# Altium project SAM3X-EK_REVB.PrjPcb (part 1 of 2)
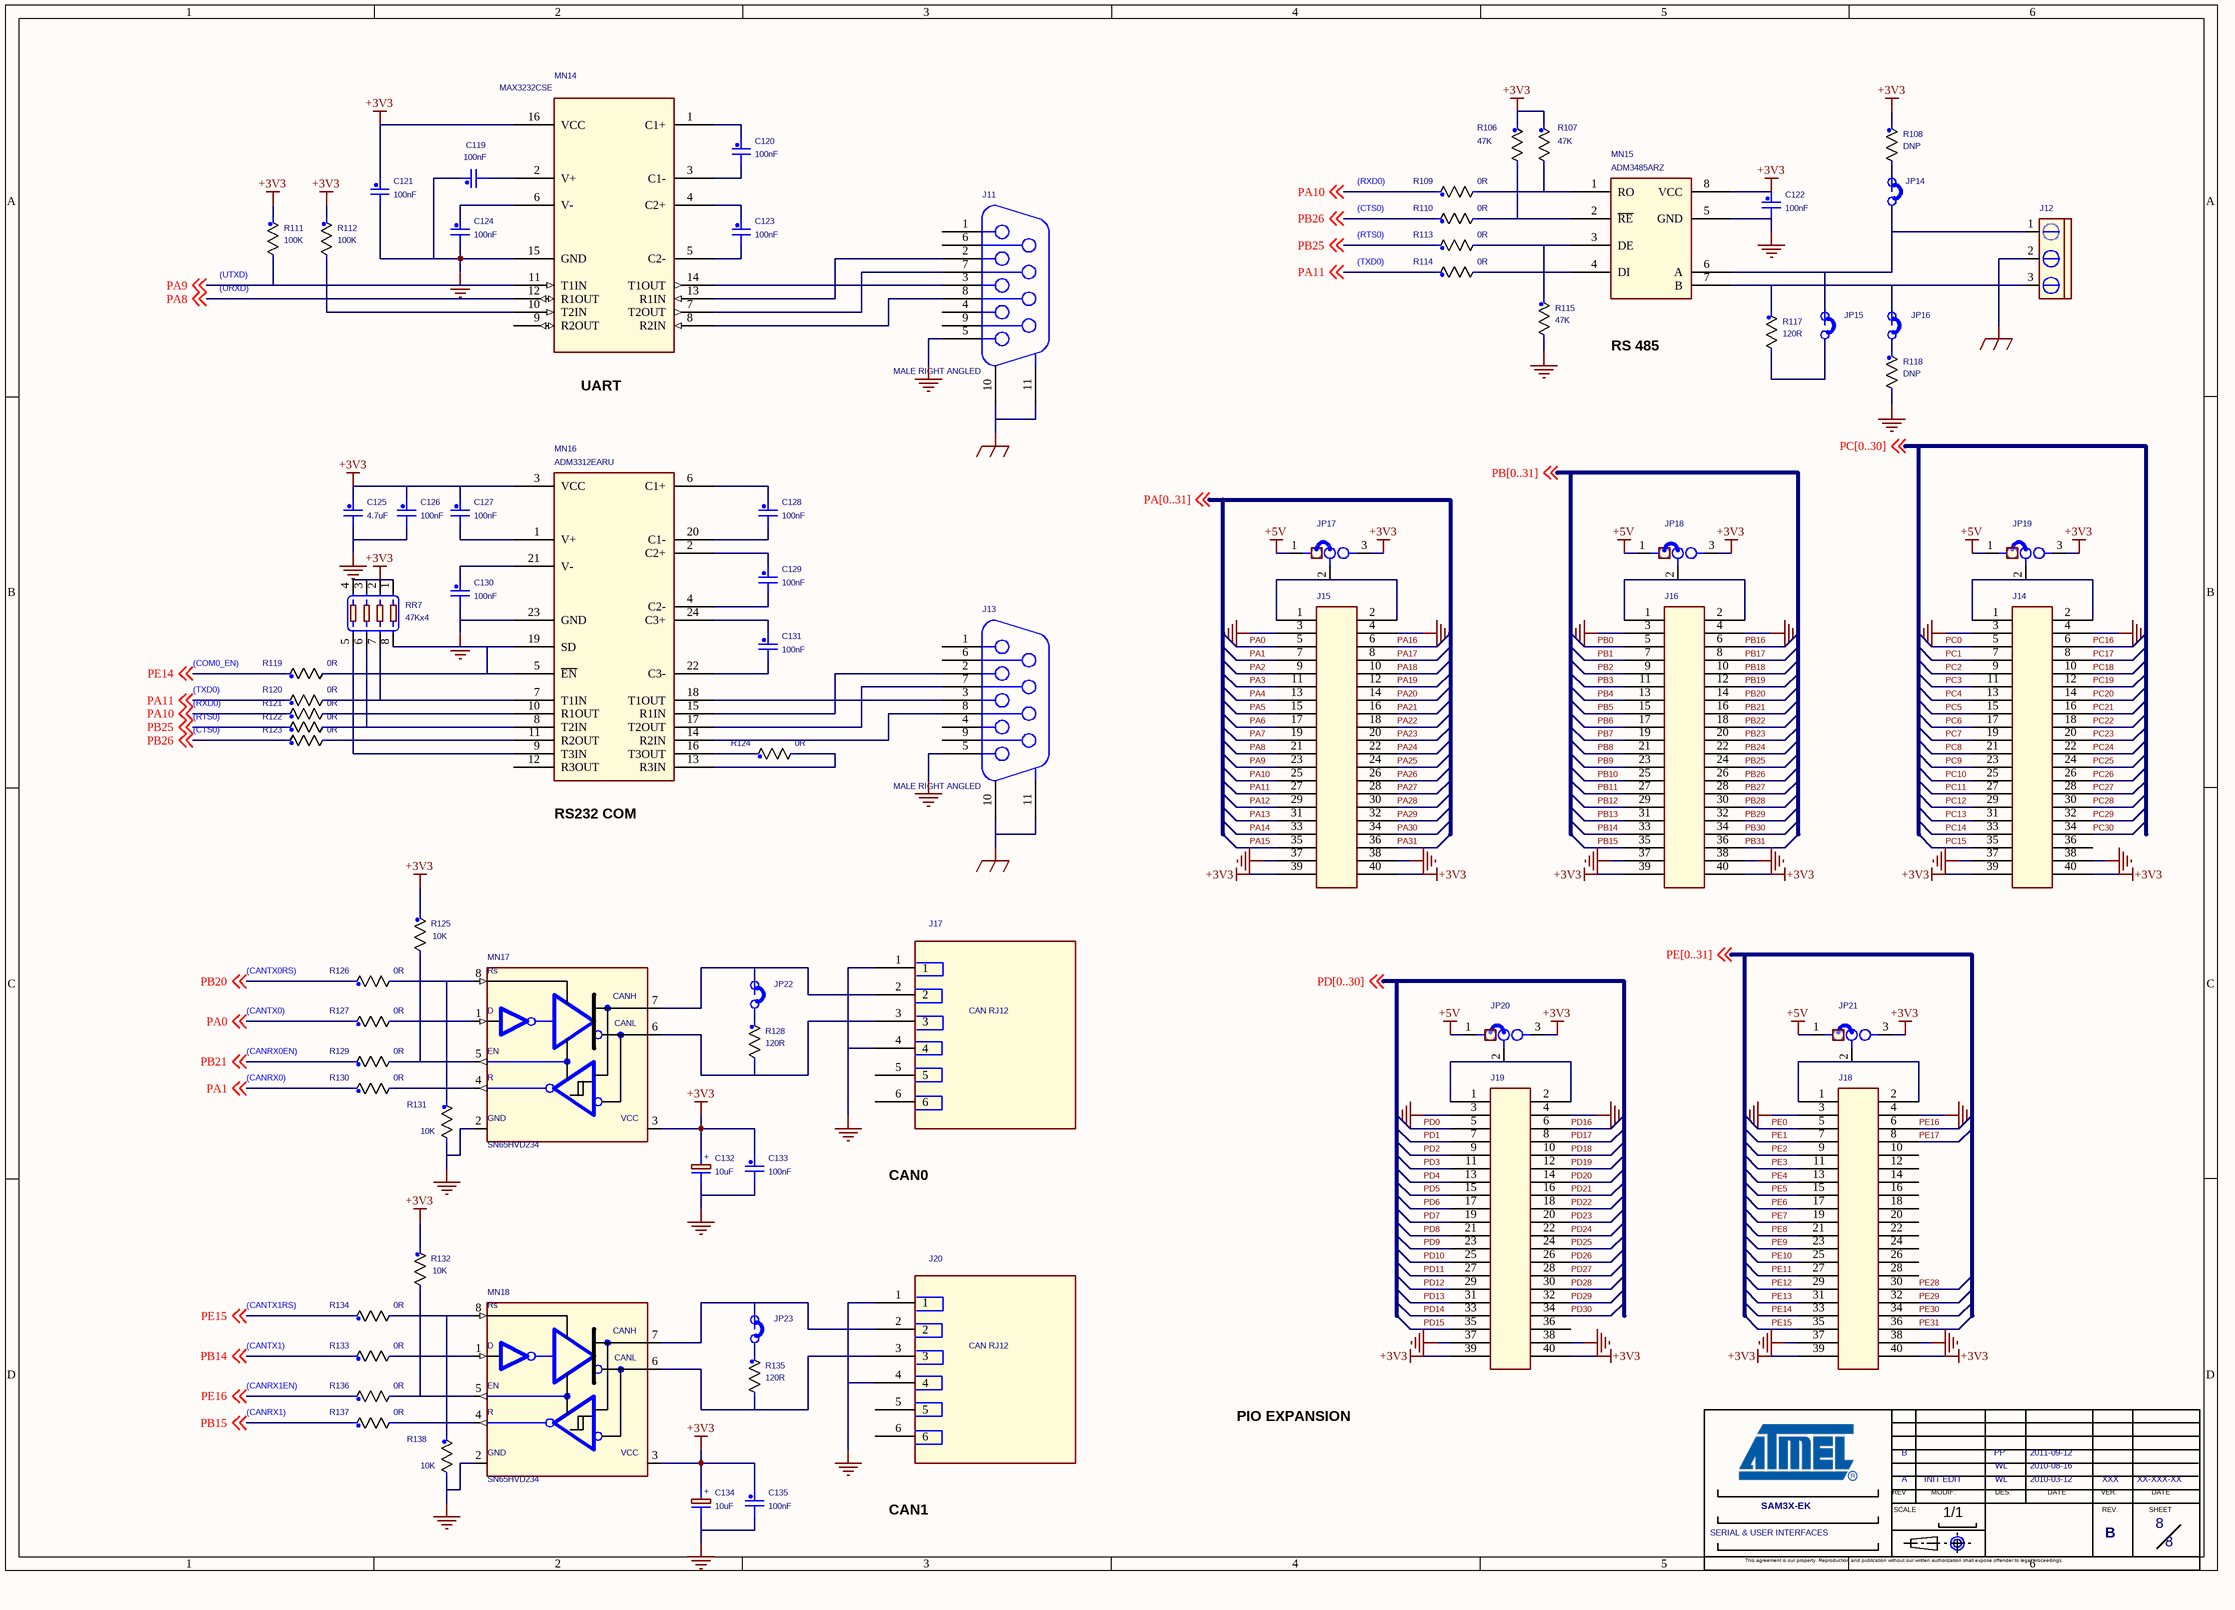
[diagram p0: 08_SERIAL & USER INTERF.SchDoc]
8 sheets, 417 parts. Net scope: global (net labels, ports and power ports of the same name join across sheets).
Sheets:
  08_SERIAL & USER INTERF.SchDoc
  07_ETHERNET & ZIGBEE.SchDoc
  06_Audio & HSMCI & TWI.SchDoc
  05_DISPLAY & QTouch.SchDoc
  04_EBI_MEMORY.SchDoc
  03_ATSAM3X_LFBGA217.SchDoc
  02_POWER SUPPLY & USB &.SchDoc
  01_TOP LEVEL.SchDoc

## Sheet 08_SERIAL & USER INTERF.SchDoc
size 420 x 297 mm

### Parts
(Parts that share a designator on the sheet are numbered #1, #2 ... from top to bottom, then left to right.)
*#1  SHEET NAME 1: SERIAL & USER INTERFACES  REV C: B  VERIF A: XXX  VERIF DATE A: XX-XXX-XX  Page Count: 8  DATE A: 2010-03-12  DATE B: 2010-08-16  DATE C: 2011-09-12  DES A: WL  DES C: PP  BOARD NAME: SAM3X-EK  VERSION: A  MODIF. DESCRIBE: INIT EDIT  (hidden comment: ATMEL ARM)  (graphical)
C119  100nF  [CAP0805]
C120  100nF  [CAP0805]
C121  100nF  [CAP0805]
C122  100nF  [CAP0805]
C123  100nF  [CAP0805]
C124  100nF  [CAP0805]
C125  4.7uF  [CAP0805]
C126  100nF  [CAP0805]
C127  100nF  [CAP0805]
C128  100nF  [CAP0805]
C129  100nF  [CAP0805]
C130  100nF  [CAP0805]
C131  100nF  [CAP0805]
C132  10uF  [C3216-18]
C133  100nF  [CAP0805]
C134  10uF  [C3216-18]
C135  100nF  [CAP0805]
J11  VAL: MALE RIGHT ANGLED  [SUBD9M_H_C]  (hidden comment: SUBD9_M_COUDE)
J12  7143-035S  [7143-035s]  (value not drawn)
J13  VAL: MALE RIGHT ANGLED  [SUBD9M_H_C]  (hidden comment: SUBD9_M_COUDE)
J14  048  [jms_tsm-2x20pts]  (value not drawn)
J15  048  [jms_tsm-2x20pts]  (value not drawn)
J16  048  [jms_tsm-2x20pts]  (value not drawn)
J17  CAN RJ12  [RJ12-55503]
J18  048  [jms_tsm-2x20pts]  (value not drawn)
J19  048  [jms_tsm-2x20pts]  (value not drawn)
J20  CAN RJ12  [RJ12-55503]
JP14  JP  [BAR2PTS02]  (value not drawn)
JP15  JP  [BAR2PTS02]  (value not drawn)
JP16  JP  [BAR2PTS02]  (value not drawn)
JP17  header3-100  [BAR3PTS02]  (value not drawn)
JP18  header3-100  [BAR3PTS02]  (value not drawn)
JP19  header3-100  [BAR3PTS02]  (value not drawn)
JP20  header3-100  [BAR3PTS02]  (value not drawn)
JP21  header3-100  [BAR3PTS02]  (value not drawn)
JP22  JP  [BAR2PTS02]  (value not drawn)
JP23  JP  [BAR2PTS02]  (value not drawn)
MN14  MAX3232CSE  [so16]
MN15  ADM3485ARZ  [so8]
MN16  ADM3312EARU  [tssop24]
MN17  SN65HVD234  [SO08]
MN18  SN65HVD234  [SO08]
R106  47K  [R0603]
R107  47K  [R0603]
R108  DNP  [r0603]
R109  0R  [r0603]
R110  0R  [r0603]
R111  100K  [r0603]
R112  100K  [r0603]
R113  0R  [r0603]
R114  0R  [r0603]
R115  47K  [R0603]
R117  120R  [r0603]
R118  DNP  [r0603]
R119  0R  [r0603]
R120  0R  [r0603]
R121  0R  [r0603]
R122  0R  [r0603]
R123  0R  [r0603]
R124  0R  [r0603]
R125  10K  [R0603]
R126  0R  [r0603]
R127  0R  [r0603]
R128  120R  [r0603]
R129  0R  [r0603]
R130  0R  [r0603]
R131  10K  [R0603]
R132  10K  [R0603]
R133  0R  [r0603]
R134  0R  [r0603]
R135  120R  [r0603]
R136  0R  [r0603]
R137  0R  [r0603]
R138  10K  [R0603]
RR7  47Kx4  [RESP4R]
SH20  Jumper Pitch 2.54  [JUMPER-2.54]  (value not drawn)
SH21  Jumper Pitch 2.54  [JUMPER-2.54]  (value not drawn)
SH22  Jumper Pitch 2.54  [JUMPER-2.54]  (value not drawn)
SH23  Jumper Pitch 2.54  [JUMPER-2.54]  (value not drawn)
SH24  Jumper Pitch 2.54  [JUMPER-2.54]  (value not drawn)
SH25  Jumper Pitch 2.54  [JUMPER-2.54]  (value not drawn)
SH26  Jumper Pitch 2.54  [JUMPER-2.54]  (value not drawn)
SH27  Jumper Pitch 2.54  [JUMPER-2.54]  (value not drawn)
SH28  Jumper Pitch 2.54  [JUMPER-2.54]  (value not drawn)
SH29  Jumper Pitch 2.54  [JUMPER-2.54]  (value not drawn)

### Nets
+3V3: C121.1 C122.1 C125.1 C126.1 C127.1 C132.1 C133.1 C134.1 C135.1 J14.39 J14.40 J15.39 J15.40 J16.39 J16.40 J18.39 J18.40 J19.39 J19.40 JP17.3 JP18.3 JP19.3 JP20.3 JP21.3 MN14.16(VCC) MN15.8(VCC) MN16.3(VCC) MN17.3(VCC) MN18.3(VCC) R106.1 R107.1 R108.1 R111.1 R112.1 R125.1 R132.1 RR7.1 RR7.2 RR7.3 RR7.4
+5V: JP17.1 JP18.1 JP19.1 JP20.1 JP21.1
GND_EARTH: J11.10(M1) J11.11(M2) J12.2 J13.10(M1) J13.11(M2)
GND_POWER: C119.1 C121.2 C122.2 C124.2 C125.2 C126.2 C130.2 C132.2 C133.2 C134.2 C135.2 J11.5 J13.5 J14.3 J14.4 J14.37 J14.38 J15.3 J15.4 J15.37 J15.38 J16.3 J16.4 J16.37 J16.38 J17.1 J17.4 J18.3 J18.4 J18.37 J18.38 J19.3 J19.4 J19.37 J19.38 J20.1 J20.4 MN14.15(GND) MN15.5(GND) MN16.23(GND) MN17.2(GND) MN18.2(GND) R115.2 R118.2 R131.2 R138.2
PA0: J15.5 R127.1 ; off-sheet PA0
PA1: J15.7 R130.1 ; off-sheet PA1
PA2: J15.9
PA3: J15.11
PA4: J15.13
PA5: J15.15
PA6: J15.17
PA7: J15.19
PA8: J15.21 MN14.12(R1OUT) ; off-sheet PA8
PA9: J15.23 MN14.11(T1IN) R111.2 ; off-sheet PA9
PA10: J15.25 R109.1 R121.1 ; off-sheet PA10
PA11: J15.27 R114.1 R120.1 ; off-sheet PA11
PA12: J15.29
PA13: J15.31
PA14: J15.33
PA15: J15.35
PA16: J15.6
PA17: J15.8
PA18: J15.10
PA19: J15.12
PA20: J15.14
PA21: J15.16
PA22: J15.18
PA23: J15.20
PA24: J15.22
PA25: J15.24
PA26: J15.26
PA27: J15.28
PA28: J15.30
PA29: J15.32
PA30: J15.34
PA31: J15.36
PB0: J16.5
PB1: J16.7
PB2: J16.9
PB3: J16.11
PB4: J16.13
PB5: J16.15
PB6: J16.17
PB7: J16.19
PB8: J16.21
PB9: J16.23
PB10: J16.25
PB11: J16.27
PB12: J16.29
PB13: J16.31
PB14: J16.33 R133.1 ; off-sheet PB14
PB15: J16.35 R137.1 ; off-sheet PB15
PB16: J16.6
PB17: J16.8
PB18: J16.10
PB19: J16.12
PB20: J16.14 R126.1 ; off-sheet PB20
PB21: J16.16 R129.1 ; off-sheet PB21
PB22: J16.18
PB23: J16.20
PB24: J16.22
PB25: J16.24 R113.1 R122.1 ; off-sheet PB25
PB26: J16.26 R110.1 R123.1 ; off-sheet PB26
PB27: J16.28
PB28: J16.30
PB29: J16.32
PB30: J16.34
PB31: J16.36
PC0: J14.5
PC1: J14.7
PC2: J14.9
PC3: J14.11
PC4: J14.13
PC5: J14.15
PC6: J14.17
PC7: J14.19
PC8: J14.21
PC9: J14.23
PC10: J14.25
PC11: J14.27
PC12: J14.29
PC13: J14.31
PC14: J14.33
PC15: J14.35
PC16: J14.6
PC17: J14.8
PC18: J14.10
PC19: J14.12
PC20: J14.14
PC21: J14.16
PC22: J14.18
PC23: J14.20
PC24: J14.22
PC25: J14.24
PC26: J14.26
PC27: J14.28
PC28: J14.30
PC29: J14.32
PC30: J14.34
PD0: J19.5
PD1: J19.7
PD2: J19.9
PD3: J19.11
PD4: J19.13
PD5: J19.15
PD6: J19.17
PD7: J19.19
PD8: J19.21
PD9: J19.23
PD10: J19.25
PD11: J19.27
PD12: J19.29
PD13: J19.31
PD14: J19.33
PD15: J19.35
PD16: J19.6
PD17: J19.8
PD18: J19.10
PD19: J19.12
PD20: J19.14
PD21: J19.16
PD22: J19.18
PD23: J19.20
PD24: J19.22
PD25: J19.24
PD26: J19.26
PD27: J19.28
PD28: J19.30
PD29: J19.32
PD30: J19.34
PE0: J18.5
PE1: J18.7
PE2: J18.9
PE3: J18.11
PE4: J18.13
PE5: J18.15
PE6: J18.17
PE7: J18.19
PE8: J18.21
PE9: J18.23
PE10: J18.25
PE11: J18.27
PE12: J18.29
PE13: J18.31
PE14: J18.33 R119.1 ; off-sheet PE14
PE15: J18.35 R134.1 ; off-sheet PE15
PE16: J18.6 R136.1 ; off-sheet PE16
PE17: J18.8
PE28: J18.30
PE29: J18.32
PE30: J18.34
PE31: J18.36
NetC119_2: C119.2 MN14.2(V+)
NetC120_1: C120.1 MN14.1(C1+)
NetC120_2: C120.2 MN14.3(C1-)
NetC123_1: C123.1 MN14.4(C2+)
NetC123_2: C123.2 MN14.5(C2-)
NetC124_1: C124.1 MN14.6(V-)
NetC127_2: C127.2 MN16.1(V+)
NetC128_1: C128.1 MN16.6(C1+)
NetC128_2: C128.2 MN16.20(C1-)
NetC129_1: C129.1 MN16.2(C2+)
NetC129_2: C129.2 MN16.4(C2-)
NetC130_1: C130.1 MN16.21(V-)
NetC131_1: C131.1 MN16.24(C3+)
NetC131_2: C131.2 MN16.22(C3-)
NetJ11_2: J11.2 MN14.13(R1IN)
NetJ11_3: J11.3 MN14.14(T1OUT)
NetJ11_7: J11.7 MN14.7(T2OUT)
NetJ11_8: J11.8 MN14.8(R2IN)
NetJ12_1: J12.1 JP14.2 JP15.1 MN15.6(A)
NetJ12_3: J12.3 JP16.1 MN15.7(B) R117.1
NetJ13_2: J13.2 MN16.15(R1IN)
NetJ13_3: J13.3 MN16.18(T1OUT)
NetJ13_7: J13.7 MN16.17(T2OUT)
NetJ13_8: J13.8 MN16.14(R2IN)
NetJ14_1: J14.1 J14.2 JP19.2
NetJ15_1: J15.1 J15.2 JP17.2
NetJ16_1: J16.1 J16.2 JP18.2
NetJ17_2: J17.2 JP22.1 MN17.7(CANH)
NetJ17_3: J17.3 MN17.6(CANL) R128.2
NetJ18_1: J18.1 J18.2 JP21.2
NetJ19_1: J19.1 J19.2 JP20.2
NetJ20_2: J20.2 JP23.1 MN18.7(CANH)
NetJ20_3: J20.3 MN18.6(CANL) R135.2
NetJP14_1: JP14.1 R108.2
NetJP15_2: JP15.2 R117.2
NetJP16_2: JP16.2 R118.1
NetJP22_2: JP22.2 R128.1
NetJP23_2: JP23.2 R135.1
NetMN14_10: MN14.10(T2IN) R112.2
NetMN15_1: MN15.1(RO) R107.2 R109.2
NetMN15_2: MN15.2(~{RE}) R106.2 R110.2
NetMN15_3: MN15.3(DE) R113.2 R115.1
NetMN15_4: MN15.4(DI) R114.2
NetMN16_5: MN16.5(~{EN}) MN16.19(SD) R119.2 RR7.8
NetMN16_7: MN16.7(T1IN) R120.2 RR7.7
NetMN16_8: MN16.8(T2IN) R122.2 RR7.6
NetMN16_9: MN16.9(T3IN) RR7.5
NetMN16_10: MN16.10(R1OUT) R121.2
NetMN16_11: MN16.11(R2OUT) R123.2
NetMN16_13: MN16.13(R3IN) R124.2
NetMN16_16: MN16.16(T3OUT) R124.1
NetMN17_1: MN17.1(TXD) R127.2
NetMN17_4: MN17.4(RXD) R130.2
NetMN17_5: MN17.5(VREF) R125.2 R129.2
NetMN17_8: MN17.8(RS) R126.2 R131.1
NetMN18_1: MN18.1(TXD) R133.2
NetMN18_4: MN18.4(RXD) R137.2
NetMN18_5: MN18.5(VREF) R132.2 R136.2
NetMN18_8: MN18.8(RS) R134.2 R138.1

Not connected (* = marked no-connect by the designer): J11 1 4 6 9; J13 1 4 6 9; J14 36; J17 5 6; J18 10 12 14 16 18 20 22 24 26 28; J19 36; J20 5 6; MN14 9(R2OUT); MN16 12(R3OUT)

### Notes on the sheet
- (RXD0)
- (RTS0)
- (CTS0)
- (near R111) (UTXD)
- (near R111) (URXD)
- (TXD0)
- UART
- RS 485
- (COM0_EN)
- (near MN16) RS232 COM
- (CANTX0RS)
- (CANTX0)
- (CANRX0EN)
- (CANRX0)
- CAN0
- (CANTX1RS)
- (CANRX1EN)
- (CANTX1)
- (CANRX1)
- PIO EXPANSION
- CAN1
- (in symbol ATMEL ARM) REV; MODIF.; DES.; DATE; VER.; SCALE; REV.; SHEET; 1/1; This agreement is our property. Reproduction and publication without our written authorization shall expose offender to legal proceedings.
- (in symbol CAP_PN) +
- (in symbol SN65HVD234 SO8) Rs; D; EN; R

### Library data of the parts
*#1 = ATMEL ARM: REV D: D; REV F: F; REV E: E; REV B: B; VERIF F: XXX; VERIF E: XXX; VERIF D: XXX; VERIF C: XXX; VERIF B: XXX; VERIF DATE F: XX-XXX-XX; VERIF DATE E: XX-XXX-XX; VERIF DATE D: XX-XXX-XX; VERIF DATE C: XX-XXX-XX; REV: B; VERIF DATE B: XX-XXX-XX; FT: ?; Page Number: 8; Page Size: A; Page Create Date: june 19, 2004; DATE D: XX-XXX-XX; DATE E: XX-XXX-XX; DATE F: XX-XXX-XX; DES E: XXX; DES F: XXX; DES B: WL; DES D: XXX
C119 C121 C123 C127 C128 C131 C133 C135 = C_Generic: Toler.: 10%; P/N #1: C0603C104K4RAC; Voltage: 16V; Mfg #1: KEMET; Dielectric: X7R; REF: C1608X7R1C104KT; FAB: TDK; DEV: C0603; DESIG: Ceramic Capacitor; BOI: 0603; TOL: 10%; TEN: 16V; VAL: 100nF
C120 C122 C124 C126 C129 C130 = C_Generic: Toler.: 10%; P/N #1: C0603C104K4RAC; Voltage: 16V; Mfg #1: KEMET; Dielectric: X7R; BOI: 0603; DESIG: Ceramic Capacitor; DEV: C0603; FAB: TDK; REF: C1608X7R1C104KT; VAL: 100nF; TEN: 16V; TOL: 10%
C125 = C_Generic: Toler.: 10%; P/N #1: C0603C104K4RAC; Voltage: 16V; Mfg #1: KEMET; Dielectric: X5R; BOI: 0805; DESIG: X5R CERAMIC CAPACITOR; DEV: C0805; FAB: TDK; REF: C2012X5R1C475KT; VAL: 4.7uF; TEN: 16V; TOL: 10%
C132 C134 = CAP_PN: SDTSourceLibName: C:\WINDOWS\TEMP\SNDS.LIB; BOI: A; DESIG: LOW ESR TANTALUM CAPACITOR; DEV: 3216; FAB: AVX; REF: TPSA106K010R1800; TEN: 10V; TOL: 10%; Dielectric: X5R; VAL: 10uF
J11 J13 = SUBD9_M_COUDE: DESIG: D-SUB 9  RIGHT ANGLED MALE; FAB: leyconn; REF: 021000014; DEV: SUBD9M_H_C
J12 = MKDS 1/3-3.81: FAB: LEYCO; DESIG: 3 Positions, 5.0 mm pitch Printed circuit terminal block; DEV: TBT_MKDS1-3X3-81_01; VAL: 7143-035S; REF: 7143-035S
J14 J16 = SDIC40_2.54mm: DESIG: 2.54mm Pin Header,Dual Row,S.M.T; FAB: SHENZHEN SITUO; REF: 048; VAL: 048
J15 J18 J19 = SDIC40_2.54mm: FAB: SHENZHEN SITUO; DESIG: 2.54mm Pin Header,Dual Row,S.M.T; VAL: 048; REF: 048
J17 J20 = RJ12-6: FAB: leyconn; VAL: 55503; REF: 55503
JP14-JP16 JP22 JP23 = JUMP_0: DESIG: 2.54mm Pin Header,Single Row,Straight/Right Angle(2pin); FAB: SHENZHEN SITUO; REF: 045; VAL: 045
JP17-JP21 = TSW 3PTS-DROIT_0: DESIG: Single Row Terminal Strips; BOI: TSW; FAB: SAMTEC; RoHS: YES; DEV: HEADER3-100; REF: header3-100; VAL: header3-100; PN: header3-100
MN14 = max232: FAB: MAXIM; DESIG: Tranceiver RS232; VAL: MAX3232CSE; REF: MAX3232CSE; DEV: SO16; BOI: SO16
MN15 = ADM3394: FAB: ADI; DESIG: Half-Duplex RS-485 Transceiver; BOI: SOIC8; Val: ADM3485ARZ; REF: ADM3485ARZ
MN16 = ADM3312E: FAB: ADI; DESIG: Serial Port Tranceiver; BOI: TSSOP24; REF: ADM3312EARU; Val: ADM3312EARU
MN17 MN18 = SN65HVD234 SO8: FAB: TI; BOI: SO8; DESIG: 3.3V CAN TRANCEIVER; REF: SN65HVD234D; VAL: SN65HVD234; DEV: SO08
R106 R107 = R_Generic: P/N #1: CR10-1001F-T; BOI: 0603; DESIG: RC21 5%; FAB: YAGEO; REF: RC0603JR-0747KL; TOL: 5%; DEV: R0603; VAL: 47K
R108 = R_Generic: P/N #1: CR10-1001F-T; TOL: 5%; VAL: NOT POPULATED; FAB: YAGEO; DESIG: RC21 5%; BOI: 0603; DEV: R0603
R109 R110 R114 R124 R126 R127 R130 R133 R134 R137 = R_Generic: P/N #1: CR10-1001F-T; TOL: 5%; REF: RC0603JR-070RL; FAB: YAGEO; DESIG: RC21 5%; BOI: 0603; VAL: 0R; DEV: R0603
R111 = R_Generic: P/N #1: CR10-1001F-T; TOL: 5%; REF: RC0603JR-07100KL; FAB: YAGEO; DESIG: RC21 5%; BOI: 0603; VAL: 100K; DEV: R0603
R112 = R_Generic: P/N #1: CR10-1001F-T; BOI: 0603; DESIG: RC21 5%; FAB: YAGEO; REF: RC0603JR-07100KL; TOL: 5%; DEV: R0603; VAL: 100K
R113 R119-R123 R129 R136 = R_Generic: P/N #1: CR10-1001F-T; BOI: 0603; DESIG: RC21 5%; FAB: YAGEO; REF: RC0603JR-070RL; TOL: 5%; DEV: R0603; VAL: 0R
R115 = R_Generic: P/N #1: CR10-1001F-T; TOL: 5%; REF: RC0603JR-0747KL; FAB: YAGEO; DESIG: RC21 5%; BOI: 0603; VAL: 47K; DEV: R0603
R117 = R_Generic: P/N #1: CR10-1001F-T; BOI: 0603; DESIG: RC21 5%; FAB: YAGEO; REF: RC0603JR-07120RL; TOL: 5%; DEV: R0603; VAL: 120R
R118 = R_Generic: P/N #1: CR10-1001F-T; BOI: 0603; DESIG: RC21 5%; FAB: YAGEO; VAL: NOT POPULATED; TOL: 5%; DEV: R0603
R125 R131 R132 R138 = R_Generic: P/N #1: CR10-1001F-T; TOL: 5%; REF: RC0603JR-0710KL; FAB: YAGEO; DESIG: RC21 5%; BOI: 0603; VAL: 10K; DEV: R0603
R128 R135 = R_Generic: P/N #1: CR10-1001F-T; TOL: 5%; REF: RC0603JR-07120RL; FAB: YAGEO; DESIG: RC21 5%; BOI: 0603; VAL: 120R; DEV: R0603
RR7 = RES_ARRAY: TOL: 5%; REF: YC124JR-0747K; FAB: YAGEO; DESIG: Chip Resistor Arrays; BOI: YC124; VAL: 47Kx4
SH20-SH22 SH26 SH29 = JUMPER-2.54: Jumper,2 Points Jumper Pitch 2.54; Part Number: 440-00002-1; Manufacturer: WIESON; Manufacturer Part Number: G4160-1A60BF1U; FAB: NA; REF: JUMPER 2.54; DESIG: 2 POINTS JUMPER PITCH 2.54; VAL: JUMPER 2.54; BOI: NA; Part Type: Jumper
SH23-SH25 SH27 SH28 = JUMPER-2.54: Jumper,2 Points Jumper Pitch 2.54; Manufacturer Part Number: G4160-1A60BF1U; Manufacturer: WIESON; Part Number: 440-00002-1; FAB: NA; REF: JUMPER 2.54; DESIG: 2 POINTS JUMPER PITCH 2.54; VAL: JUMPER 2.54; BOI: NA; Part Type: Jumper

## Sheet 07_ETHERNET & ZIGBEE.SchDoc
size 420 x 297 mm
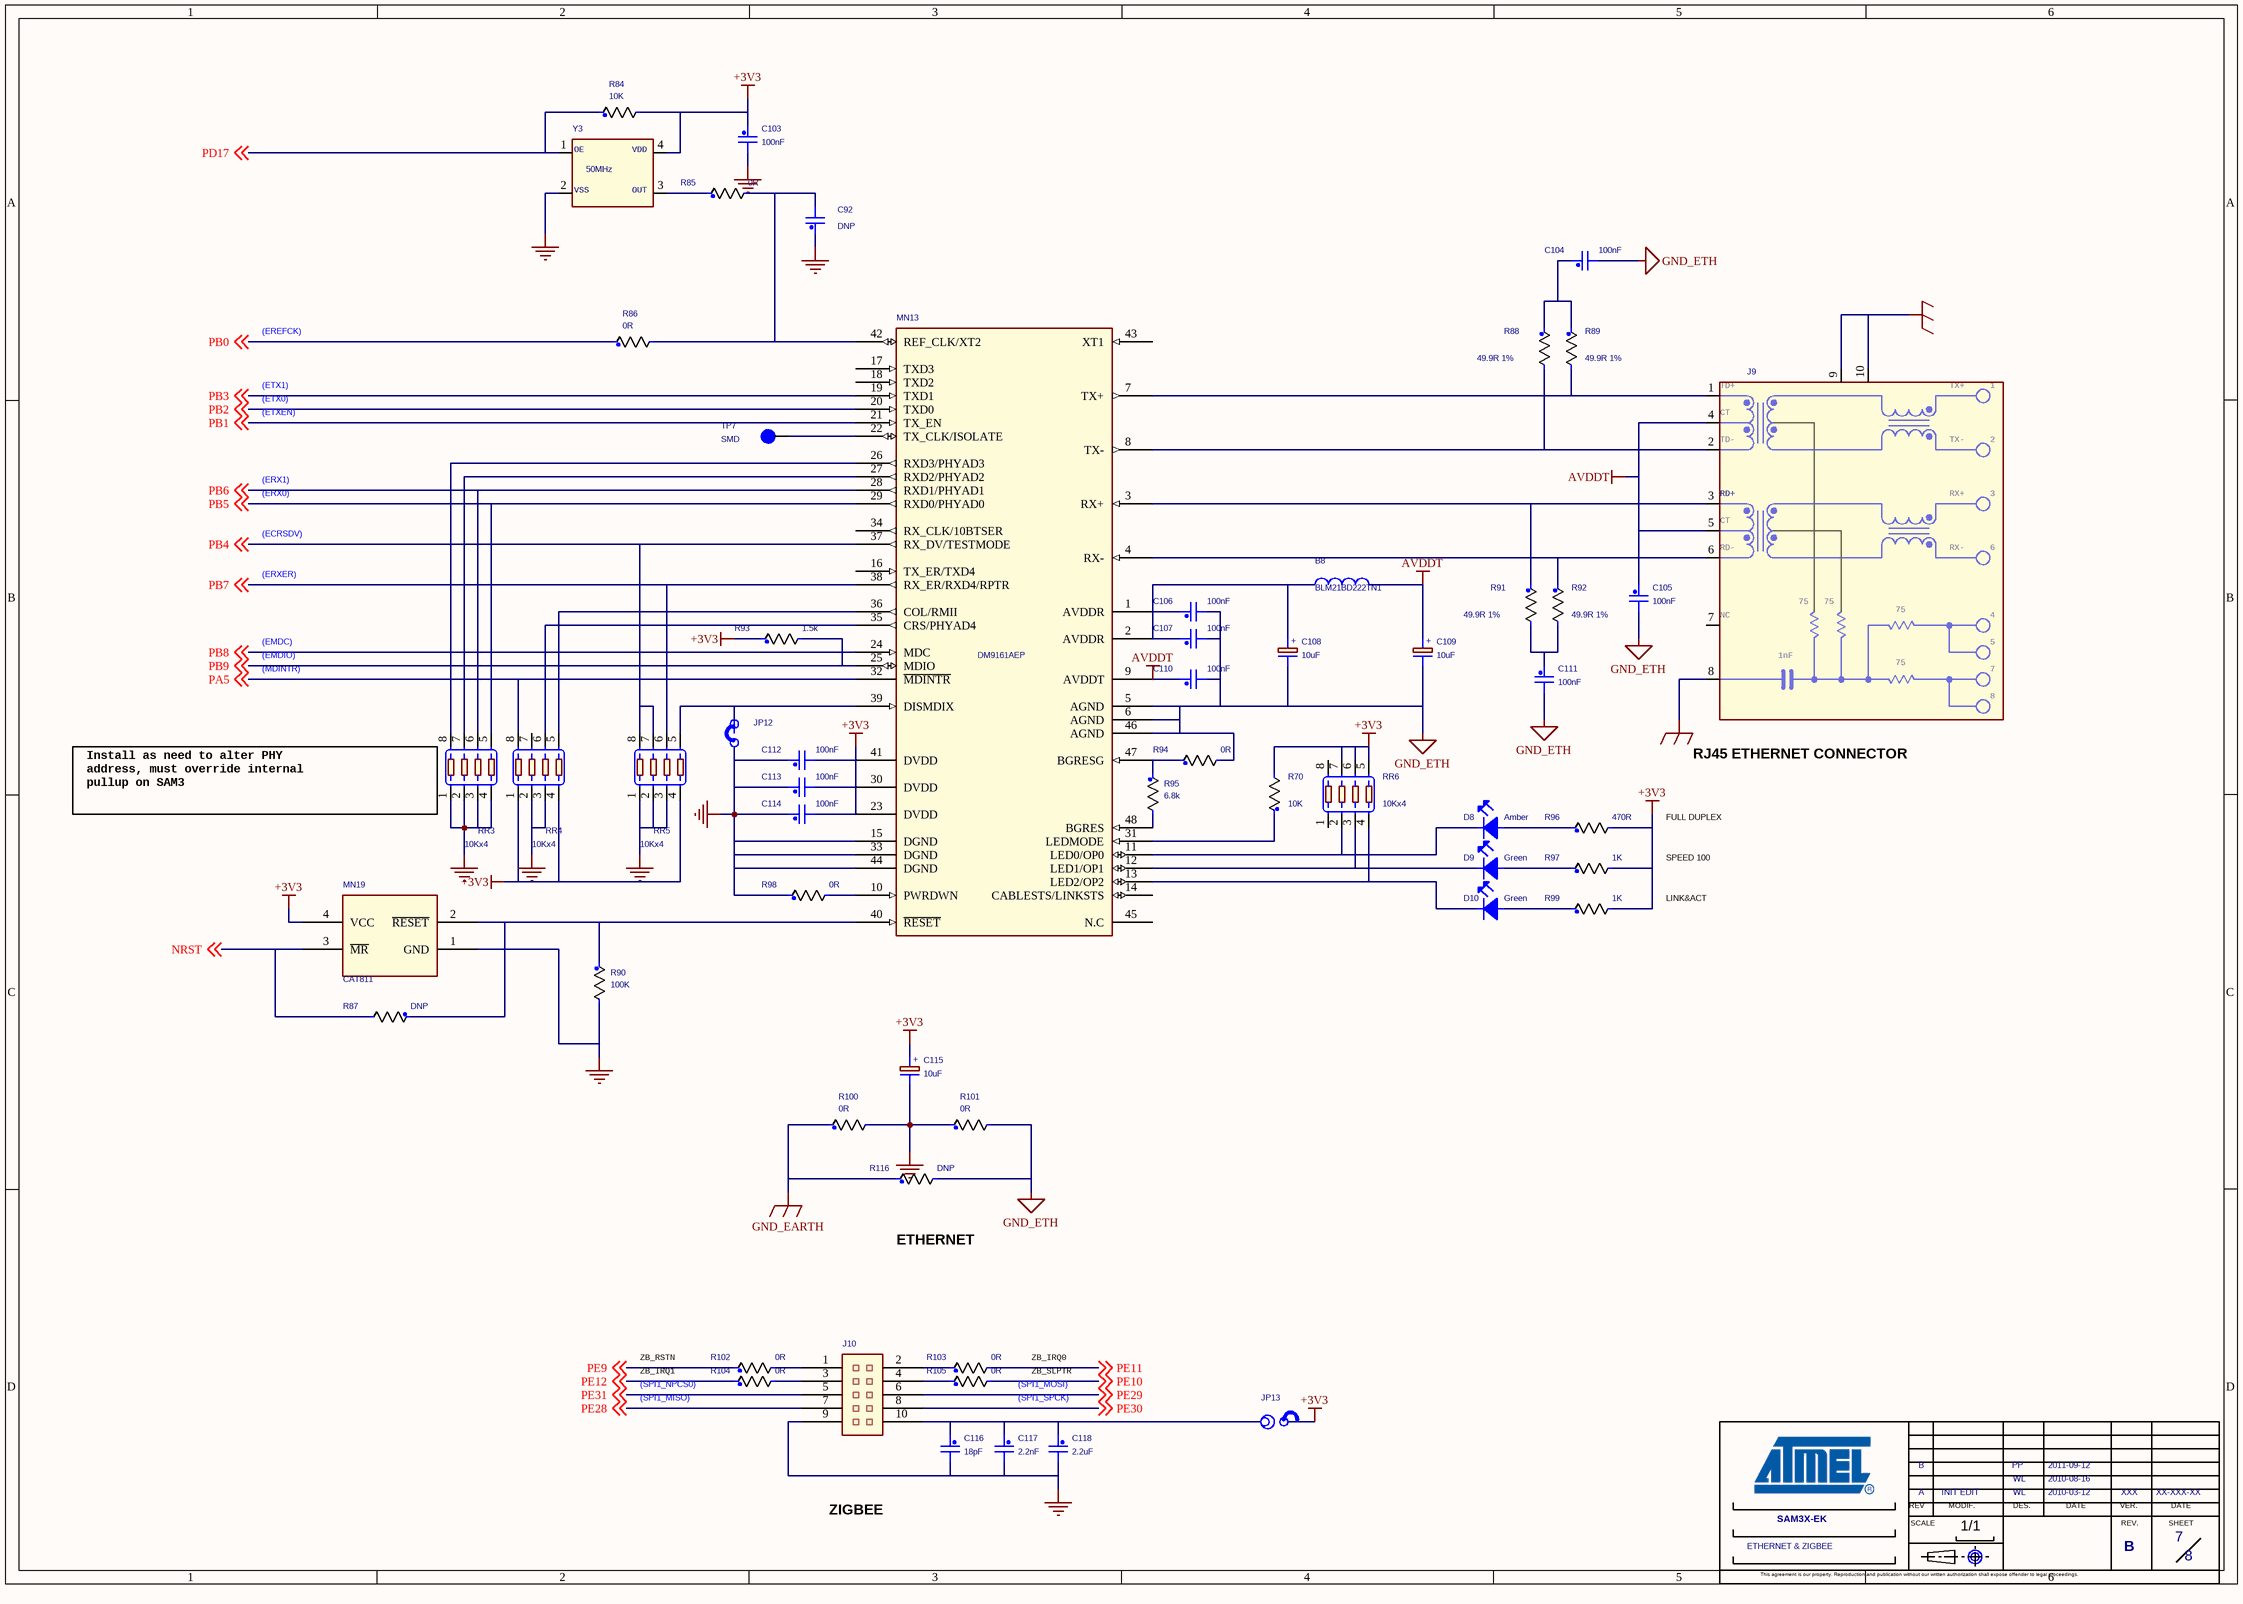
[diagram p1: 07_ETHERNET & ZIGBEE.SchDoc]

### Parts
(Parts that share a designator on the sheet are numbered #1, #2 ... from top to bottom, then left to right.)
*#2  SHEET NAME 1: ETHERNET & ZIGBEE  REV C: B  VERIF A: XXX  VERIF DATE A: XX-XXX-XX  Page Count: 8  Page Number: 7  DATE A: 2010-03-12  DATE B: 2010-08-16  DATE C: 2011-09-12  DES A: WL  DES C: PP  BOARD NAME: SAM3X-EK  VERSION: A  MODIF. DESCRIBE: INIT EDIT  (hidden comment: ATMEL ARM)  (graphical)
B8  BLM21BD222TN1  [LC1206]
C92  DNP  [CAP0805]
C103  100nF  [CAP0805]
C104  100nF  [CAP0805]
C105  100nF  [CAP0805]
C106  100nF  [CAP0805]
C107  100nF  [CAP0805]
C108  10uF  [C3216-18]
C109  10uF  [C3216-18]
C110  100nF  [CAP0805]
C111  100nF  [CAP0805]
C112  100nF  [CAP0805]
C113  100nF  [CAP0805]
C114  100nF  [CAP0805]
C115  10uF  [C3216-18]
C116  18pF  [CAP0805]
C117  2.2nF  [CAP0805]
C118  2.2uF  [CAP0805]
D8  Amber  [LED0805]
D9  Green  [LED0805]
D10  Green  [LED0805]
J9  13F-64NDXNL  [RJ45_PULSE]  (value not drawn)
J10  SDIC10  [SIDC10]  (value not drawn)
JP12  JP  [BAR2PTS02]  (value not drawn)
JP13  JP  [BAR2PTS02]  (value not drawn)
MN13  DM9161AEP  [lqfp48]
MN19  CAT811  [SOT143]
R70  10K  [R0603]
R84  10K  [R0603]
R85  0R  [R0603]
R86  0R  [R0603]
R87  DNP  [R0603]
R88  49.9R 1%  [R0603]
R89  49.9R 1%  [R0603]
R90  100K  [R0603]
R91  49.9R 1%  [R0603]
R92  49.9R 1%  [R0603]
R93  1.5k  [r0603]
R94  0R  [R0603]
R95  6.8k  [R0603]
R96  470R  [R0603]
R97  1K  [r0603]
R98  0R  [R0603]
R99  1K  [r0603]
R100  0R  [R0603]
R101  0R  [R0603]
R102  0R  [r0603]
R103  0R  [r0603]
R104  0R  [r0603]
R105  0R  [r0603]
R116  DNP  [R0603]
RR3  10Kx4  [RESP4R]
RR4  10Kx4  [RESP4R]
RR5  10Kx4  [RESP4R]
RR6  10Kx4  [RESP4R]
SH18  Jumper Pitch 2.54  [JUMPER-2.54]  (value not drawn)
SH19  Jumper Pitch 2.54  [JUMPER-2.54]  (value not drawn)
TP7  SMD  [P1A]
Y3  50MHz  [OS-5032]

### Nets
+3V3: C103.1 C112.2 C113.2 C114.2 C115.1 JP13.2 MN13.23(DVDD) MN13.30(DVDD) MN13.41(DVDD) MN19.4(VCC) R70.2 R84.2 R93.1 R96.2 R97.2 R99.2 RR4.1 RR4.4 RR5.4 RR6.5 RR6.6 RR6.7 Y3.4(VDD)
AVDDT: B8.2 C105.1 C109.1 C110.1 J9.4(P4) J9.5(P5) MN13.9(AVDDT)
GND_EARTH: J9.8(P8) J9.9(P9) J9.10(P10) R100.1 R116.1
GND_ETH: C104.2 C105.2 C106.2 C107.2 C108.2 C109.2 C110.2 C111.2 MN13.5(AGND) MN13.6(AGND) MN13.46(AGND) R94.2 R101.2 R116.2
GND_POWER: C92.1 C103.2 C112.1 C113.1 C114.1 C115.2 C116.2 C117.2 C118.2 J10.9 JP12.2 MN13.15(DGND) MN13.33(DGND) MN13.44(DGND) MN19.1(GND) R90.2 R98.1 R100.2 R101.1 RR3.1 RR3.2 RR3.3 RR3.4 RR4.2 RR4.3 RR5.1 RR5.2 RR5.3 Y3.2(VSS)
NRST: MN19.3(~{MR}) R87.2 ; off-sheet NRST
PA5: MN13.32(~{MDINTR}) RR4.8 ; off-sheet PA5
PB0: R86.1 ; off-sheet PB0
PB1: MN13.21(TX_EN) ; off-sheet PB1
PB2: MN13.20(TXD0) ; off-sheet PB2
PB3: MN13.19(TXD1) ; off-sheet PB3
PB4: MN13.37(RX_DV/TESTMODE) RR5.7 RR5.8 ; off-sheet PB4
PB5: MN13.29(RXD0/PHYAD0) RR3.5 ; off-sheet PB5
PB6: MN13.28(RXD1/PHYAD1) RR3.6 ; off-sheet PB6
PB7: MN13.38(RX_ER/RXD4/RPTR) RR5.6 ; off-sheet PB7
PB8: MN13.24(MDC) ; off-sheet PB8
PB9: MN13.25(MDIO) R93.2 ; off-sheet PB9
PD17: R84.1 Y3.1(OE) ; off-sheet PD17
PE9: R102.1 ; off-sheet PE9
PE10: R105.2 ; off-sheet PE10
PE11: R103.2 ; off-sheet PE11
PE12: R104.1 ; off-sheet PE12
PE28: J10.7 ; off-sheet PE28
PE29: J10.6 ; off-sheet PE29
PE30: J10.8 ; off-sheet PE30
PE31: J10.5 ; off-sheet PE31
NetB8_1: B8.1 C106.1 C107.1 C108.1 MN13.1(AVDDR) MN13.2(AVDDR)
NetC92_2: C92.2 MN13.42(REF_CLK/XT2) R85.2 R86.2
NetC104_1: C104.1 R88.1 R89.1
NetC111_1: C111.1 R91.2 R92.2
NetC116_1: C116.1 C117.1 C118.1 J10.10 JP13.1
NetD8_1: D8.1(A) R96.1
NetD8_2: D8.2(K) MN13.11(LED0/OP0) RR6.2
NetD9_1: D9.1(A) R97.1
NetD9_2: D9.2(K) MN13.12(LED1/OP1) RR6.3
NetD10_1: D10.1(A) R99.1
NetD10_2: D10.2(K) MN13.13(LED2/OP2) RR6.4
NetJ9_1: J9.1(P1) MN13.7(TX+) R89.2
NetJ9_2: J9.2(P2) MN13.8(TX-) R88.2
NetJ9_3: J9.3(P3) MN13.3(RX+) R91.1
NetJ9_6: J9.6(P6) MN13.4(RX-) R92.1
NetJ10_1: J10.1 R102.2
NetJ10_2: J10.2 R103.1
NetJ10_3: J10.3 R104.2
NetJ10_4: J10.4 R105.1
NetJP12_1: JP12.1 MN13.39(DISMDIX) RR5.5
NetMN13_10: MN13.10(PWRDWN) R98.2
NetMN13_22: MN13.22(TX_CLK/ISOLATE) TP7.1(TP)
NetMN13_26: MN13.26(RXD3/PHYAD3) RR3.8
NetMN13_27: MN13.27(RXD2/PHYAD2) RR3.7
NetMN13_31: MN13.31(LEDMODE) R70.1
NetMN13_35: MN13.35(CRS/PHYAD4) RR4.6
NetMN13_36: MN13.36(COL/RMII) RR4.5
NetMN13_40: MN13.40(~{RESET}) MN19.2(~{RESET}) R87.1 R90.1
NetMN13_47: MN13.47(BGRESG) R94.1 R95.1
NetMN13_48: MN13.48(BGRES) R95.2
NetR85_1: R85.1 Y3.3(OUT)

Not connected (* = marked no-connect by the designer): J9 7(P7); MN13 14(CABLESTS/LINKSTS) 16(TX_ER/TXD4) 17(TXD3) 18(TXD2) 34(RX_CLK/10BTSER) 43(XT1) 45(N.C); RR4 7; RR6 1 8

### Notes on the sheet
- (ETX1)
- (EREFCK)
- (ETX0)
- (ETXEN)
- (ERX1)
- (ERX0)
- (ERXER)
- (ECRSDV)
- (EMDC)
- (EMDIO)
- (MDINTR)
- (near RR3) Install as need to alter PHY
  address, must override internal
  pullup on SAM3
- RJ45 ETHERNET CONNECTOR
- SPEED 100
- FULL DUPLEX
- LINK&ACT
- ETHERNET
- (SPI1_NPCS0)
- (SPI1_MISO)
- ZB_IRQ1
- ZB_RSTN
- (SPI1_MOSI)
- (SPI1_SPCK)
- ZB_IRQ0
- ZB_SLPTR
- ZIGBEE
- (in symbol ATMEL ARM) REV; MODIF.; DES.; DATE; VER.; SCALE; REV.; SHEET; 1/1; This agreement is our property. Reproduction and publication without our written authorization shall expose offender to legal proceedings.
- (in symbol CAP_PN) +
- (in symbol RJ45 MAGNETICS) TD+; TX+; CT; TD-; TX-; RD+; RX+; RD-; RX-; 75; NC; 1nF

### Library data of the parts
*#2 = ATMEL ARM: REV D: D; REV F: F; REV E: E; REV B: B; VERIF F: XXX; VERIF E: XXX; VERIF D: XXX; VERIF C: XXX; VERIF B: XXX; VERIF DATE F: XX-XXX-XX; VERIF DATE E: XX-XXX-XX; VERIF DATE D: XX-XXX-XX; VERIF DATE C: XX-XXX-XX; REV: B; VERIF DATE B: XX-XXX-XX; FT: ?; Page Size: A; Page Create Date: june 19, 2004; DATE D: XX-XXX-XX; DATE E: XX-XXX-XX; DATE F: XX-XXX-XX; DES E: XXX; DES F: XXX; DES B: WL; DES D: XXX
B8 = inductor: VAL: 2200ohm@100MHz; FAB: Wurth Electronics Inc; DEV: R0805; DESIG: SMD EMI Suppression Ferrite Beads; BOI: 0805; REF: BLM21BD222TN1
C92 = C_Generic: Toler.: 10%; P/N #1: C0603C104K4RAC; Voltage: 16V; Mfg #1: KEMET; Dielectric: X7R; TEN: 50V; VAL: 68pF; REF: C1608X7R1H680KT; FAB: TDK; DEV: C0603; DESIG: Ceramic capacitor; BOI: 0603; TOL: 10%
C103 C104 = C_Generic: as C119 on sheet 08_SERIAL & USER INTERF; TOL: 10%; TEN: 16V; VAL: 100nF
C105-C107 C110-C114 = C_Generic: as C120 on sheet 08_SERIAL & USER INTERF; VAL: 100nF; TEN: 16V; TOL: 10%
C108 C109 C115 = CAP_PN: as C132 on sheet 08_SERIAL & USER INTERF; VAL: 10uF
C116 = C_Generic: Toler.: 10%; P/N #1: C0603C104K4RAC; Voltage: 50V; Mfg #1: KEMET; Dielectric: X7R; BOI: 0603; DESIG: Ceramic capacitor; DEV: C0603; FAB: TDK; REF: C1608X7R1H180KT; VAL: 18pF; TEN: 50V; TOL: 10%
C117 = C_Generic: Toler.: 10%; P/N #1: C0603C104K4RAC; Voltage: 50V; Mfg #1: KEMET; Dielectric: X7R; REF: C1608X7R1H222KT; FAB: TDK; DEV: C0603; DESIG: Ceramic capacitor; BOI: 0603; TOL: 10%; TEN: 50V; VAL: 2.2nF
C118 = C_Generic: Toler.: 10%; P/N #1: C0603C104K4RAC; Voltage: 50V; Mfg #1: KEMET; Dielectric: X5R; BOI: 0805; DESIG: X5R CERAMIC CAPACITOR; DEV: C0805; FAB: TDK; REF: C2012X5R1C225KT; VAL: 2.2uF; TEN: 50V; TOL: 10%
D8 = LED_Small_1: Note: 0805; DESIG: Chip Led Green; FAB: AVAGO; REF: HSMA-C170; BOI: 0805; VAL: HSMA-C170
D9 D10 = LED_Small_1: Note: 0805; VAL: HSMG-C170; FAB: AVAGO; DESIG: Chip Led Green; REF: HSMG-C170; BOI: 0805
J9 = RJ45 MAGNETICS: DESIG: 10/100 Base-TX RJ45 1x1 Tab-DOWN 8-pin Integrated Magnetics Connector.; BOI: RJ45; FAB: YUAN DEAN; RoHS: YES; REF: 13F-64NDXNL
J10 = SDIC10: DESIG: 2.54mm male Header,Dual Row,Straight (10PIN); FAB: SHENZHEN SITUO; REF: 098; VAL: 098
JP12 JP13 = JUMP_0: VAL: 045; FAB: SHENZHEN SITUO; DESIG: 2.54mm Pin Header,Single Row,Straight/Right Angle(2pin); REF: 045
MN13 = DM9161AE_0: IC,Com IC,10/100 ETH MAC with PHY,LQFP48; Part Number: 153-00004-1; DESIG: 10/100 Fast Ethernet Tranceiver MII/RMII Auto MDIX; FAB: DAVICOM; DEV: QFP48_01; REF: DM9161AEP; BOI: LQFP48; VAL: DM9161AEP; Part Type: Communication IC; Manufacturer: DAVICOM; Manufacturer Part Number: DM9161AEP
MN19 = CAT811: FAB: ON; REF: CAT811; VAL: CAT811
R70 R84 R87 = R_Generic: P/N #1: CR10-1001F-T; BOI: 0603; DESIG: RC21 5%; FAB: YAGEO; REF: RC0603JR-0710KL; TOL: 5%; DEV: R0603
  R70 R84: VAL: 10K
  R87: VAL: DNP
R85 R86 R94 R100 R101 R104 R105 = R_Generic: as R109 on sheet 08_SERIAL & USER INTERF; VAL: 0R; DEV: R0603
R88 R89 R92 = R_Generic: P/N #1: CR10-1001F-T; BOI: 0603; DESIG: RC22H 1%; FAB: YAGEO; REF: RC0603FR-0749R9L; DEV: R0603; VAL: 49.9R; TOL: 1%
R90 = R_Generic: as R112 on sheet 08_SERIAL & USER INTERF; DEV: R0603; VAL: 100K
R91 = R_Generic: P/N #1: CR10-1001F-T; REF: RC0603FR-0749R9L; FAB: YAGEO; DESIG: RC22H 1%; BOI: 0603; TOL: 1%; VAL: 49.9R; DEV: R0603
R93 = R_Generic: P/N #1: CR10-1001F-T; BOI: 0603; DESIG: RC21 5%; FAB: YAGEO; REF: RC0603JR-071K5L; TOL: 5%; DEV: R0603; VAL: 1.5K
R95 = R_Generic: P/N #1: CR10-1001F-T; TOL: 5%; REF: RC0603JR-076K8L; FAB: YAGEO; DESIG: RC21 5%; BOI: 0603; VAL: 6.8K; DEV: R0603
R96 = R_Generic: P/N #1: CR10-1001F-T; TOL: 5%; REF: RC0603JR-07470RL; FAB: YAGEO; DESIG: RC21 5%; BOI: 0603; VAL: 470R; DEV: R0603
R97 R99 = R_Generic: P/N #1: CR10-1001F-T; TOL: 5%; REF: RC0603JR-071KL; FAB: YAGEO; DESIG: RC21 5%; BOI: 0603; VAL: 1K; DEV: R0603
R98 R102 R103 = R_Generic: as R113 on sheet 08_SERIAL & USER INTERF; DEV: R0603; VAL: 0R
R116 = R_Generic: P/N #1: CR10-1001F-T; BOI: 0603; DESIG: RC21 5%; FAB: YAGEO; REF: RC0603JR-070RL; VAL: 0R; TOL: 5%; DEV: R0603
RR3 RR4 RR6 = RES_ARRAY: TOL: 5%; REF: YC124JR-0710K; FAB: YAGEO; DESIG: Chip Resistor Arrays; BOI: YC124; VAL: 10Kx4
RR5 = RES_ARRAY: BOI: YC124; DESIG: Chip Resistor Arrays; FAB: YAGEO; REF: YC124JR-0710K; TOL: 5%; VAL: 10Kx4
SH18 = JUMPER-2.54: as SH20 on sheet 08_SERIAL & USER INTERF; DESIG: 2 POINTS JUMPER PITCH 2.54; VAL: JUMPER 2.54; BOI: NA; Part Type: Jumper
SH19 = JUMPER-2.54: as SH23 on sheet 08_SERIAL & USER INTERF; DESIG: 2 POINTS JUMPER PITCH 2.54; VAL: JUMPER 2.54; BOI: NA; Part Type: Jumper
TP7 = TP: DESIG: testing PAD; FAB: NA; VAL: NOT POPULATED; REF: NA
Y3 = Oscillator: OSC,50MHz,3V3,50ppm,15pF,ROHS; FAB: ECEC; Part Type: Clock; Manufacturer Part Number: OS-5032; RoHS: Yes

## Sheet 06_Audio & HSMCI & TWI.SchDoc
size 420 x 297 mm
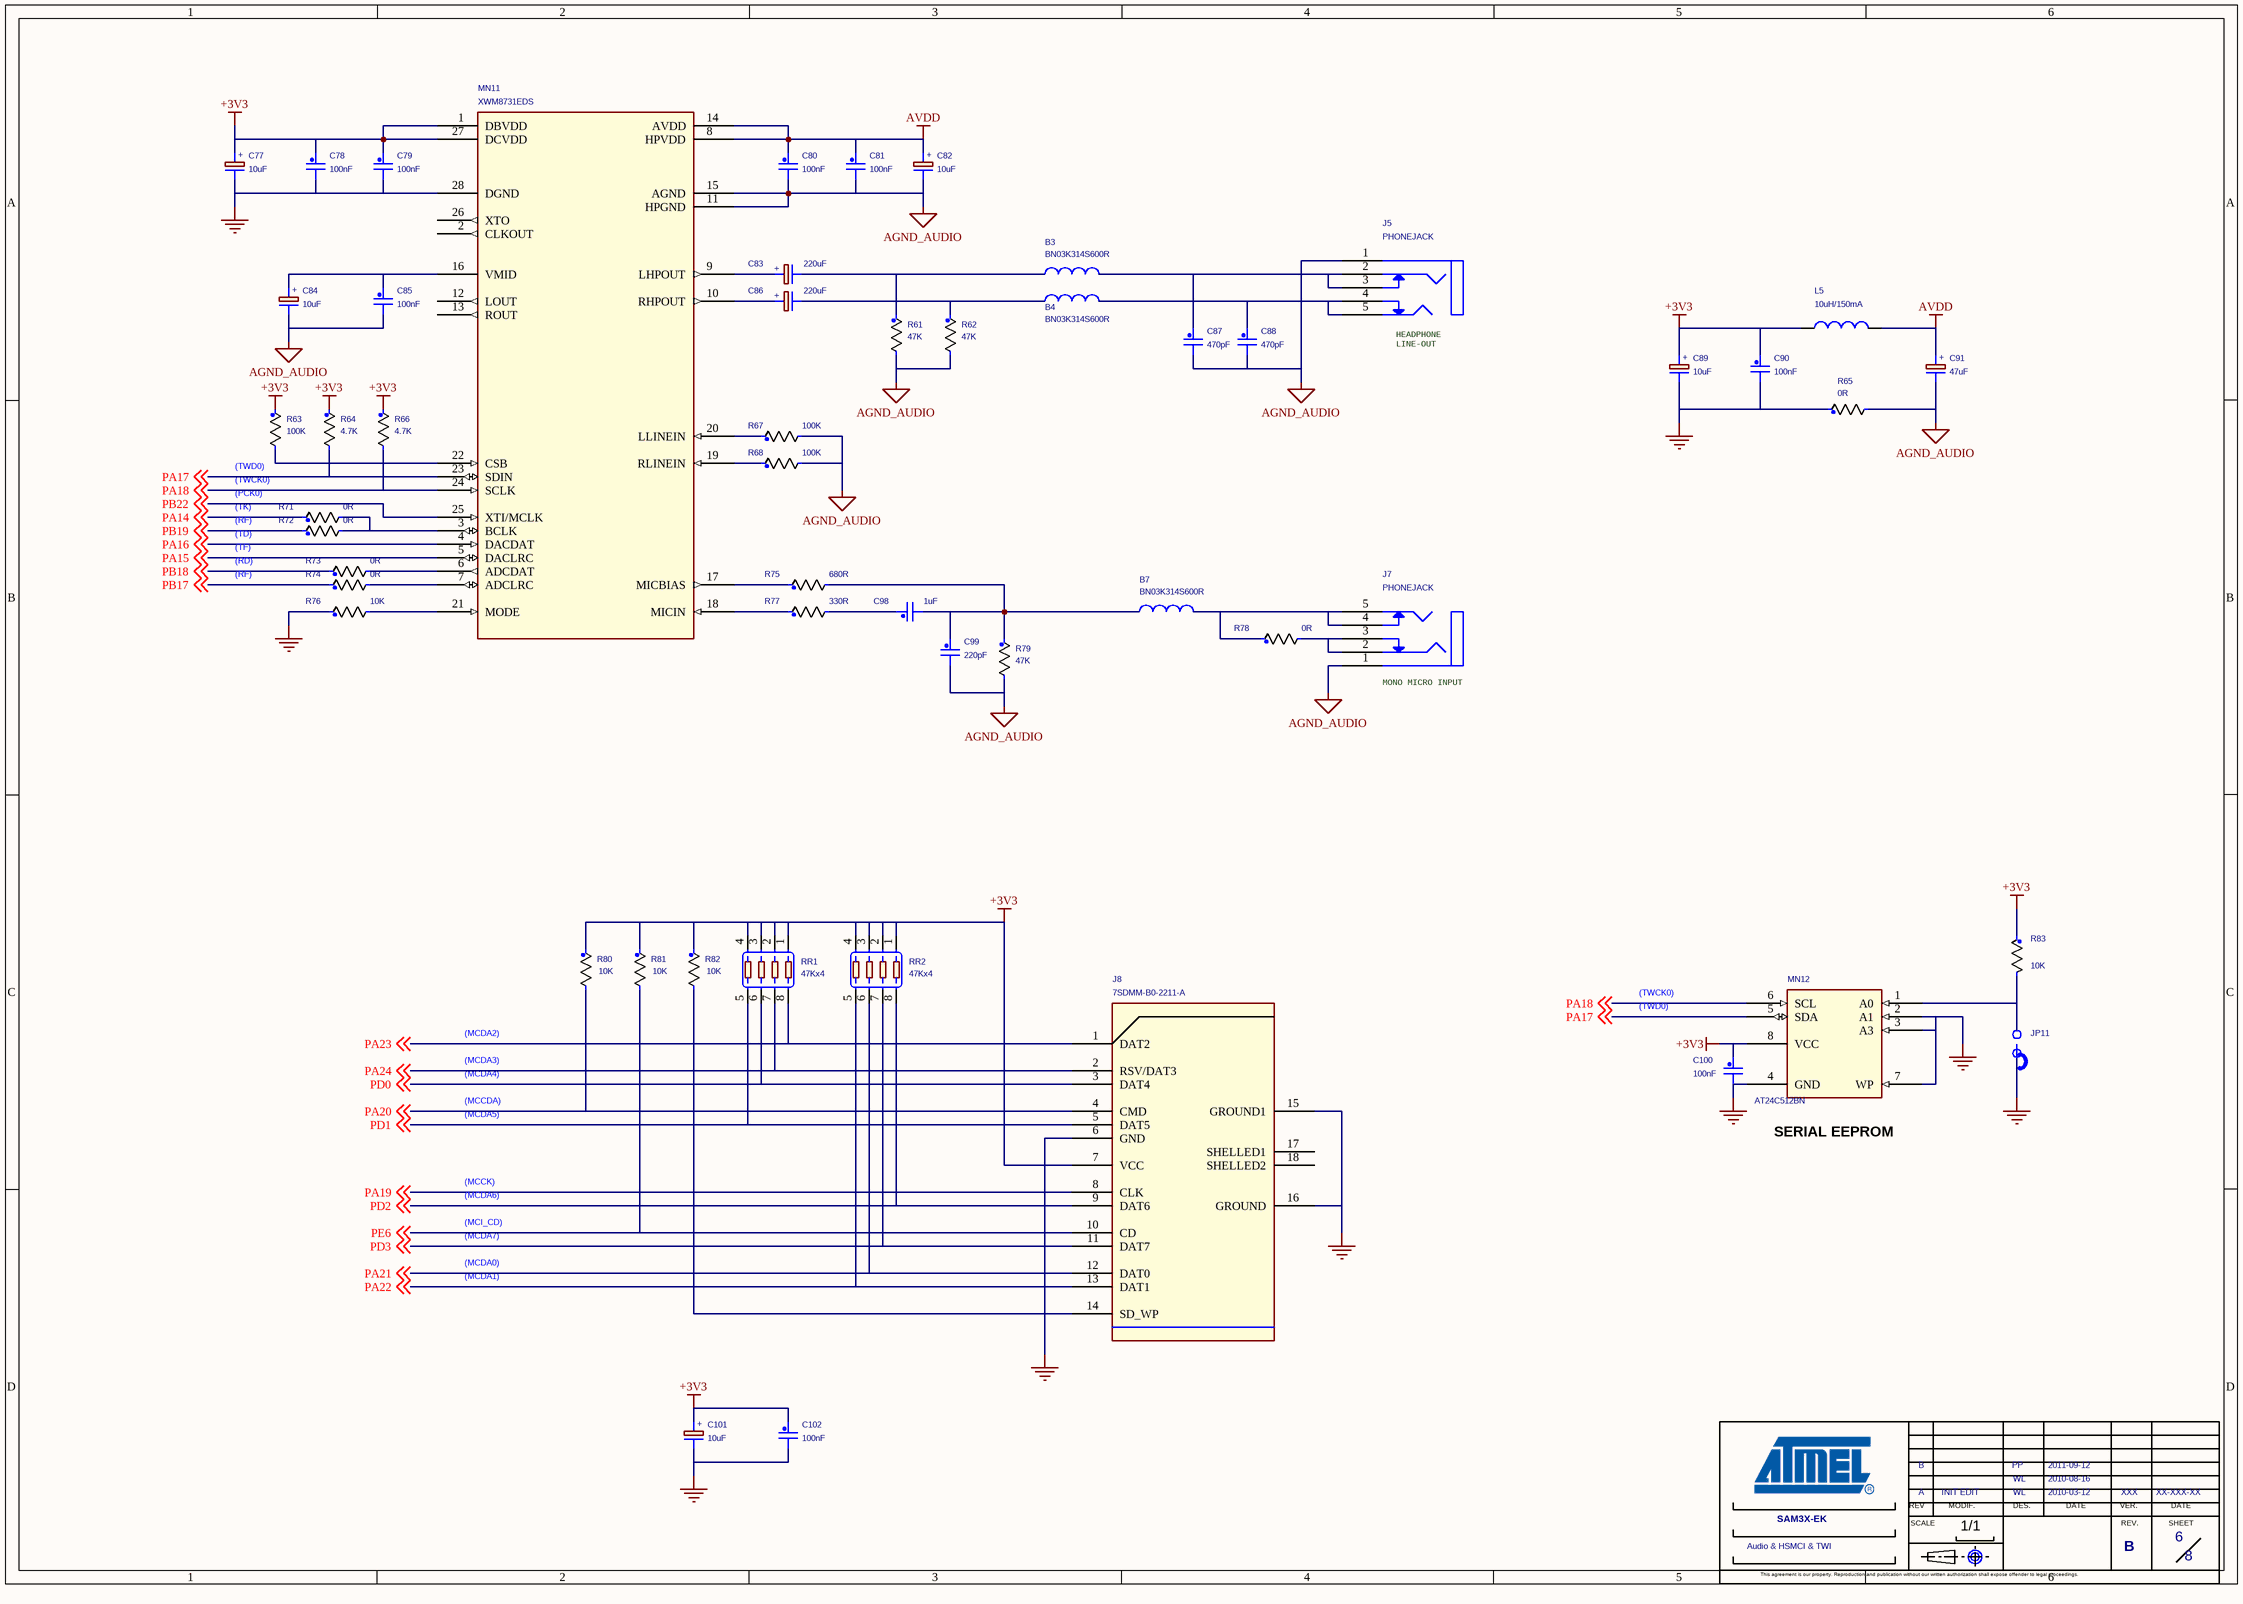
[diagram p2: 06_Audio & HSMCI & TWI.SchDoc]

### Parts
(Parts that share a designator on the sheet are numbered #1, #2 ... from top to bottom, then left to right.)
*#3  SHEET NAME 1: Audio & HSMCI & TWI  REV C: B  VERIF A: XXX  VERIF DATE A: XX-XXX-XX  Page Count: 8  Page Number: 6  DATE A: 2010-03-12  DATE B: 2010-08-16  DATE C: 2011-09-12  DES A: WL  DES C: PP  BOARD NAME: SAM3X-EK  VERSION: A  MODIF. DESCRIBE: INIT EDIT  (hidden comment: ATMEL ARM)  (graphical)
B3  BN03K314S600R  [LC1206]
B4  BN03K314S600R  [LC1206]
B7  BN03K314S600R  [LC1206]
C77  10uF  [C3216-18]
C78  100nF  [CAP0805]
C79  100nF  [CAP0805]
C80  100nF  [CAP0805]
C81  100nF  [CAP0805]
C82  10uF  [C3216-18]
C83  220uF  [T6032]
C84  10uF  [C3216-18]
C85  100nF  [CAP0805]
C86  220uF  [T6032]
C87  470pF  [CAP0805]
C88  470pF  [CAP0805]
C89  10uF  [C3216-18]
C90  100nF  [CAP0805]
C91  47uF  [C3528-21]
C98  1uF  [CAP0805]
C99  220pF  [CAP0805]
C100  100nF  [CAP0805]
C101  10uF  [C3216-18]
C102  100nF  [CAP0805]
J5  PHONEJACK  [audio_jack]
J7  PHONEJACK  [audio_jack]
J8  7SDMM-B0-2211-A  [sd-7sdmm]
JP11  JP  [BAR2PTS02]  (value not drawn)
L5  10uH/150mA  [NLFV25T]
MN11  XWM8731EDS  [TSSOP28]
MN12  AT24C512BN  [so8]
R61  47K  [R0603]
R62  47K  [R0603]
R63  100K  [R0603]
R64  4.7K  [R0603]
R65  0R  [R0603]
R66  4.7K  [R0603]
R67  100K  [R0603]
R68  100K  [R0603]
R71  0R  [R0603]
R72  0R  [R0603]
R73  0R  [R0603]
R74  0R  [R0603]
R75  680R  [R0603]
R76  10K  [R0603]
R77  330R  [R0603]
R78  0R  [R0603]
R79  47K  [R0603]
R80  10K  [R0603]
R81  10K  [R0603]
R82  10K  [R0603]
R83  10K  [R0603]
RR1  47Kx4  [RESP4R]
RR2  47Kx4  [RESP4R]
SH17  Jumper Pitch 2.54  [JUMPER-2.54]  (value not drawn)

### Nets
+3V3: C77.1 C78.1 C79.1 C89.1 C90.1 C100.1 C101.1 C102.1 J8.7(VCC) L5.2 MN11.1(DBVDD) MN11.27(DCVDD) MN12.8(VCC) R63.1 R64.1 R66.1 R80.1 R81.1 R82.1 R83.1 RR1.1 RR1.2 RR1.3 RR1.4 RR2.1 RR2.2 RR2.3 RR2.4
AGND_AUDIO: C80.2 C81.2 C82.2 C84.2 C85.2 C87.2 C88.2 C91.2 C99.2 J5.1(E) J7.1(E) MN11.11(HPGND) MN11.15(AGND) R61.2 R62.2 R65.2 R67.2 R68.2 R79.2
AVDD: C80.1 C81.1 C82.1 C91.1 L5.1 MN11.8(HPVDD) MN11.14(AVDD)
GND_POWER: C77.2 C78.2 C79.2 C89.2 C90.2 C100.2 C101.2 C102.2 J8.6(GND) J8.15(GROUND1) J8.16(GROUND) JP11.1 MN11.28(DGND) MN12.2(A1) MN12.3(A3) MN12.4(GND) MN12.7(WP) R65.1 R76.1
PA14: R71.1 ; off-sheet PA14
PA15: MN11.5(DACLRC) ; off-sheet PA15
PA16: MN11.4(DACDAT) ; off-sheet PA16
PA17: MN11.23(SDIN) MN12.5(SDA) R64.2 ; off-sheet PA17
PA18: MN11.24(SCLK) MN12.6(SCL) R66.2 ; off-sheet PA18
PA19: J8.8(CLK) ; off-sheet PA19
PA20: J8.4(CMD) R80.2 ; off-sheet PA20
PA21: J8.12(DAT0) RR2.6 ; off-sheet PA21
PA22: J8.13(DAT1) RR2.5 ; off-sheet PA22
PA23: J8.1(DAT2) RR1.8 ; off-sheet PA23
PA24: J8.2(RSV/DAT3) RR1.7 ; off-sheet PA24
PB17: R74.1 ; off-sheet PB17
PB18: R73.1 ; off-sheet PB18
PB19: R72.1 ; off-sheet PB19
PB22: MN11.25(XTI/MCLK) ; off-sheet PB22
PD0: J8.3(DAT4) RR1.6 ; off-sheet PD0
PD1: J8.5(DAT5) RR1.5 ; off-sheet PD1
PD2: J8.9(DAT6) RR2.8 ; off-sheet PD2
PD3: J8.11(DAT7) RR2.7 ; off-sheet PD3
PE6: J8.10(CD) R81.2 ; off-sheet PE6
NetB3_1: B3.1 C83.2 R61.1
NetB3_2: B3.2 C87.1 J5.2(D) J5.3(C)
NetB4_1: B4.1 C86.2 R62.1
NetB4_2: B4.2 C88.1 J5.4(B) J5.5(A)
NetB7_1: B7.1 C98.2 C99.1 R75.2 R79.1
NetB7_2: B7.2 J7.4(B) J7.5(A) R78.1
NetC83_1: C83.1 MN11.9(LHPOUT)
NetC84_1: C84.1 C85.1 MN11.16(VMID)
NetC86_1: C86.1 MN11.10(RHPOUT)
NetC98_1: C98.1 R77.2
NetJ7_2: J7.2(D) J7.3(C) R78.2
NetJ8_14: J8.14(SD_WP) R82.2
NetJP11_2: JP11.2 MN12.1(A0) R83.2
NetMN11_3: MN11.3(BCLK) R71.2 R72.2
NetMN11_6: MN11.6(ADCDAT) R73.2
NetMN11_7: MN11.7(ADCLRC) R74.2
NetMN11_17: MN11.17(MICBIAS) R75.1
NetMN11_18: MN11.18(MICIN) R77.1
NetMN11_19: MN11.19(RLINEIN) R68.1
NetMN11_20: MN11.20(LLINEIN) R67.1
NetMN11_21: MN11.21(MODE) R76.2
NetMN11_22: MN11.22(CSB) R63.2

Not connected (* = marked no-connect by the designer): J8 17(SHELLED1) 18(SHELLED2); MN11 2(CLKOUT) 12(LOUT) 13(ROUT) 26(XTO)

### Notes on the sheet
- (near J5) HEADPHONE
  LINE-OUT
- (near R63) (TWD0)
- (near R63) (TWCK0)
- (PCK0)
- (TK)
- (RF)
- (TD)
- (TF)
- (RD)
- (near J7) MONO MICRO INPUT
- (TWCK0)
- (MCDA2)
- (MCDA3)
- (TWD0)
- (MCCDA)
- (MCDA4)
- (MCDA5)
- SERIAL EEPROM
- (MCCK)
- (MCDA6)
- (MCDA7)
- (MCDA0)
- (MCI_CD)
- (MCDA1)
- (in symbol ATMEL ARM) REV; MODIF.; DES.; DATE; VER.; SCALE; REV.; SHEET; 1/1; This agreement is our property. Reproduction and publication without our written authorization shall expose offender to legal proceedings.
- (in symbol CAP_PN) +

### Library data of the parts
*#3 = ATMEL ARM: REV D: D; REV F: F; REV E: E; REV B: B; VERIF F: XXX; VERIF E: XXX; VERIF D: XXX; VERIF C: XXX; VERIF B: XXX; VERIF DATE F: XX-XXX-XX; VERIF DATE E: XX-XXX-XX; VERIF DATE D: XX-XXX-XX; VERIF DATE C: XX-XXX-XX; REV: B; VERIF DATE B: XX-XXX-XX; FT: ?; Page Size: A; Page Create Date: june 19, 2004; DATE D: XX-XXX-XX; DATE E: XX-XXX-XX; DATE F: XX-XXX-XX; DES E: XXX; DES F: XXX; DES B: WL; DES D: XXX
B3 B7 = inductor: BOI: 0603; DESIG: SMD EMI Suppression Ferrite Beads; DEV: R0603; FAB: GAUSSTEK GARP; REF: BN03K314S600R; VAL: BN03K314S600R
B4 = inductor: FAB: GAUSSTEK GARP; DEV: R0603; DESIG: SMD EMI Suppression Ferrite Beads; BOI: 0603; VAL: BN03K314S600R; REF: BN03K314S600R
C77 C82 C84 C89 = CAP_PN: as C132 on sheet 08_SERIAL & USER INTERF; VAL: 10uF
C78-C81 C85 C90 C102 = C_Generic: as C120 on sheet 08_SERIAL & USER INTERF; VAL: 100nF; TEN: 16V; TOL: 10%
C83 = CAP_PN: SDTSourceLibName: C:\WINDOWS\TEMP\SNDS.LIB; TOL: 10%; TEN: 6.3V; REF: TPSC227K006R0250; FAB: AVX; DEV: 6032; DESIG: LOW ESR TANTALUM CAPACITOR; BOI: C; Dielectric: X5R; VAL: 220uF
C86 = CAP_PN: SDTSourceLibName: C:\WINDOWS\TEMP\SNDS.LIB; BOI: C; DESIG: LOW ESR TANTALUM CAPACITOR; DEV: 6032; FAB: AVX; REF: TPSC227K006R0250; TEN: 6.3V; TOL: 10%; Dielectric: X5R; VAL: 220uF
C87 = C_Generic: Toler.: 10%; P/N #1: C0603C104K4RAC; Voltage: 50V; Mfg #1: KEMET; Dielectric: X7R; BOI: 0603; DESIG: Ceramic Capacitor; DEV: C0603; FAB: TDK; REF: C1608X7R1H471KT; TEN: 16V; VAL: 470pF; TOL: 10%
C88 = C_Generic: Toler.: 10%; P/N #1: C0603C104K4RAC; Voltage: 50V; Mfg #1: KEMET; Dielectric: X7R; TEN: 16V; REF: C1608X7R1H471KT; FAB: TDK; DEV: C0603; DESIG: Ceramic Capacitor; BOI: 0603; TOL: 10%; VAL: 470pF
C91 = CAP_PN: SDTSourceLibName: C:\WINDOWS\TEMP\SNDS.LIB; TOL: 10%; TEN: 6.3V; REF: TPSB476K010R0500; FAB: AVX; DEV: 3528O; DESIG: LOW ESR TANTALUM CAPACITOR; BOI: B; Dielectric: X5R; VAL: 47uF
C98 = C_Generic: Toler.: 10%; P/N #1: C0603C104K4RAC; Voltage: 16V; Mfg #1: KEMET; Dielectric: X5R; BOI: 0603; DESIG: X5R CERAMIC CAPACITOR; DEV: C0603; FAB: TDK; REF: C1608X5R1H105KT; TEN: 50V; VAL: 1uF; TOL: 10%
C99 = C_Generic: Toler.: 10%; P/N #1: C0603C104K4RAC; Voltage: 50V; Mfg #1: KEMET; Dielectric: X7R; TEN: 16V; REF: C1608X7R1H221KT; FAB: TDK; DEV: C0603; DESIG: Ceramic Capacitor; BOI: 0603; TOL: 10%; VAL: 220pF
C100 = C_Generic: as C119 on sheet 08_SERIAL & USER INTERF; TOL: 10%; TEN: 16V; VAL: 100nF
C101 = CAP_PN: SDTSourceLibName: C:\WINDOWS\TEMP\SNDS.LIB; Dielectric: X5R; TOL: 10%; TEN: 10V; REF: TPSA106K010R1800; FAB: AVX; DEV: 3216; DESIG: LOW ESR TANTALUM CAPACITOR; BOI: A; VAL: 10uF
J5 = PHONEJACK: FAB: SHENZHEN YUBO; REF: LF-307; VAL: 3.5 PHONEJACK STEREO
J7 = PHONEJACK: VAL: 3.5 PHONEJACK STEREO; REF: LF-307; FAB: SHENZHEN YUBO
J8 = 7SDMM-B0B2211: FAB: KINGCONN; DESIG: SD/MMC CARD CONNECTOR; REF: 7SDMM-B0-2211-A; VAL: 7SDMM-B0-2211-A
JP11 = JUMP_0: as JP14 on sheet 08_SERIAL & USER INTERF; VAL: 045
L5 = L_0: DESIG: Inductor; FAB: TDK; REF: NLFV25T-100K; VAL: 10uH/150mA
MN11 = XWM8731EDS: FAB: WOLFSON; DEV: SSOP-28; DESIG: Audio CODEC with Headphine Driver; VAL: XWM8731EDS; REF: XWM8731EDS; BOI: SSOP-28
MN12 = AT24_IICflash: IC,Flash,512Kb,IIC, 2.5V~5.5V,SOIC08; Manufacturer: ATMEL; Part Number: 131-00006-1; REF: AT24C512BN-SH25-B; Manufacturer Part Number: AT24C512BN-SH25-B; Part Type: Flash; FAB: ATMEL
R61 R79 = R_Generic: as R106 on sheet 08_SERIAL & USER INTERF; DEV: R0603; VAL: 47K
R62 = R_Generic: as R115 on sheet 08_SERIAL & USER INTERF; VAL: 47K; DEV: R0603
R63 R67 R68 = R_Generic: as R111 on sheet 08_SERIAL & USER INTERF; VAL: 100K; DEV: R0603
R64 = R_Generic: P/N #1: CR10-1001F-T; BOI: 0603; DESIG: RC21 5%; FAB: YAGEO; REF: RC0603JR-074K7L; TOL: 5%; DEV: R0603; VAL: 4.7K
R65 R72 R73 R78 = R_Generic: as R109 on sheet 08_SERIAL & USER INTERF; VAL: 0R; DEV: R0603
R66 = R_Generic: P/N #1: CR10-1001F-T; TOL: 5%; REF: RC0603JR-074K7L; FAB: YAGEO; DESIG: RC21 5%; BOI: 0603; VAL: 4.7K; DEV: R0603
R71 R74 = R_Generic: as R113 on sheet 08_SERIAL & USER INTERF; DEV: R0603; VAL: 0R
R75 = R_Generic: P/N #1: CR10-1001F-T; BOI: 0603; DESIG: RC21 5%; FAB: YAGEO; REF: RC0603JR-07680RL; TOL: 5%; DEV: R0603; VAL: 680R
R76 R80 R82 R83 = R_Generic: as R125 on sheet 08_SERIAL & USER INTERF; VAL: 10K; DEV: R0603
R77 = R_Generic: P/N #1: CR10-1001F-T; TOL: 5%; REF: RC0603JR-07330RL; FAB: YAGEO; DESIG: RC21 5%; BOI: 0603; VAL: 330R; DEV: R0603
R81 = R_Generic: as R70 on sheet 07_ETHERNET & ZIGBEE; DEV: R0603; VAL: 10K
RR1 RR2 = RES_ARRAY: as RR7 on sheet 08_SERIAL & USER INTERF; VAL: 47Kx4
SH17 = JUMPER-2.54: as SH20 on sheet 08_SERIAL & USER INTERF; DESIG: 2 POINTS JUMPER PITCH 2.54; VAL: JUMPER 2.54; BOI: NA; Part Type: Jumper

## Sheet 05_DISPLAY & QTouch.SchDoc
size 420 x 297 mm
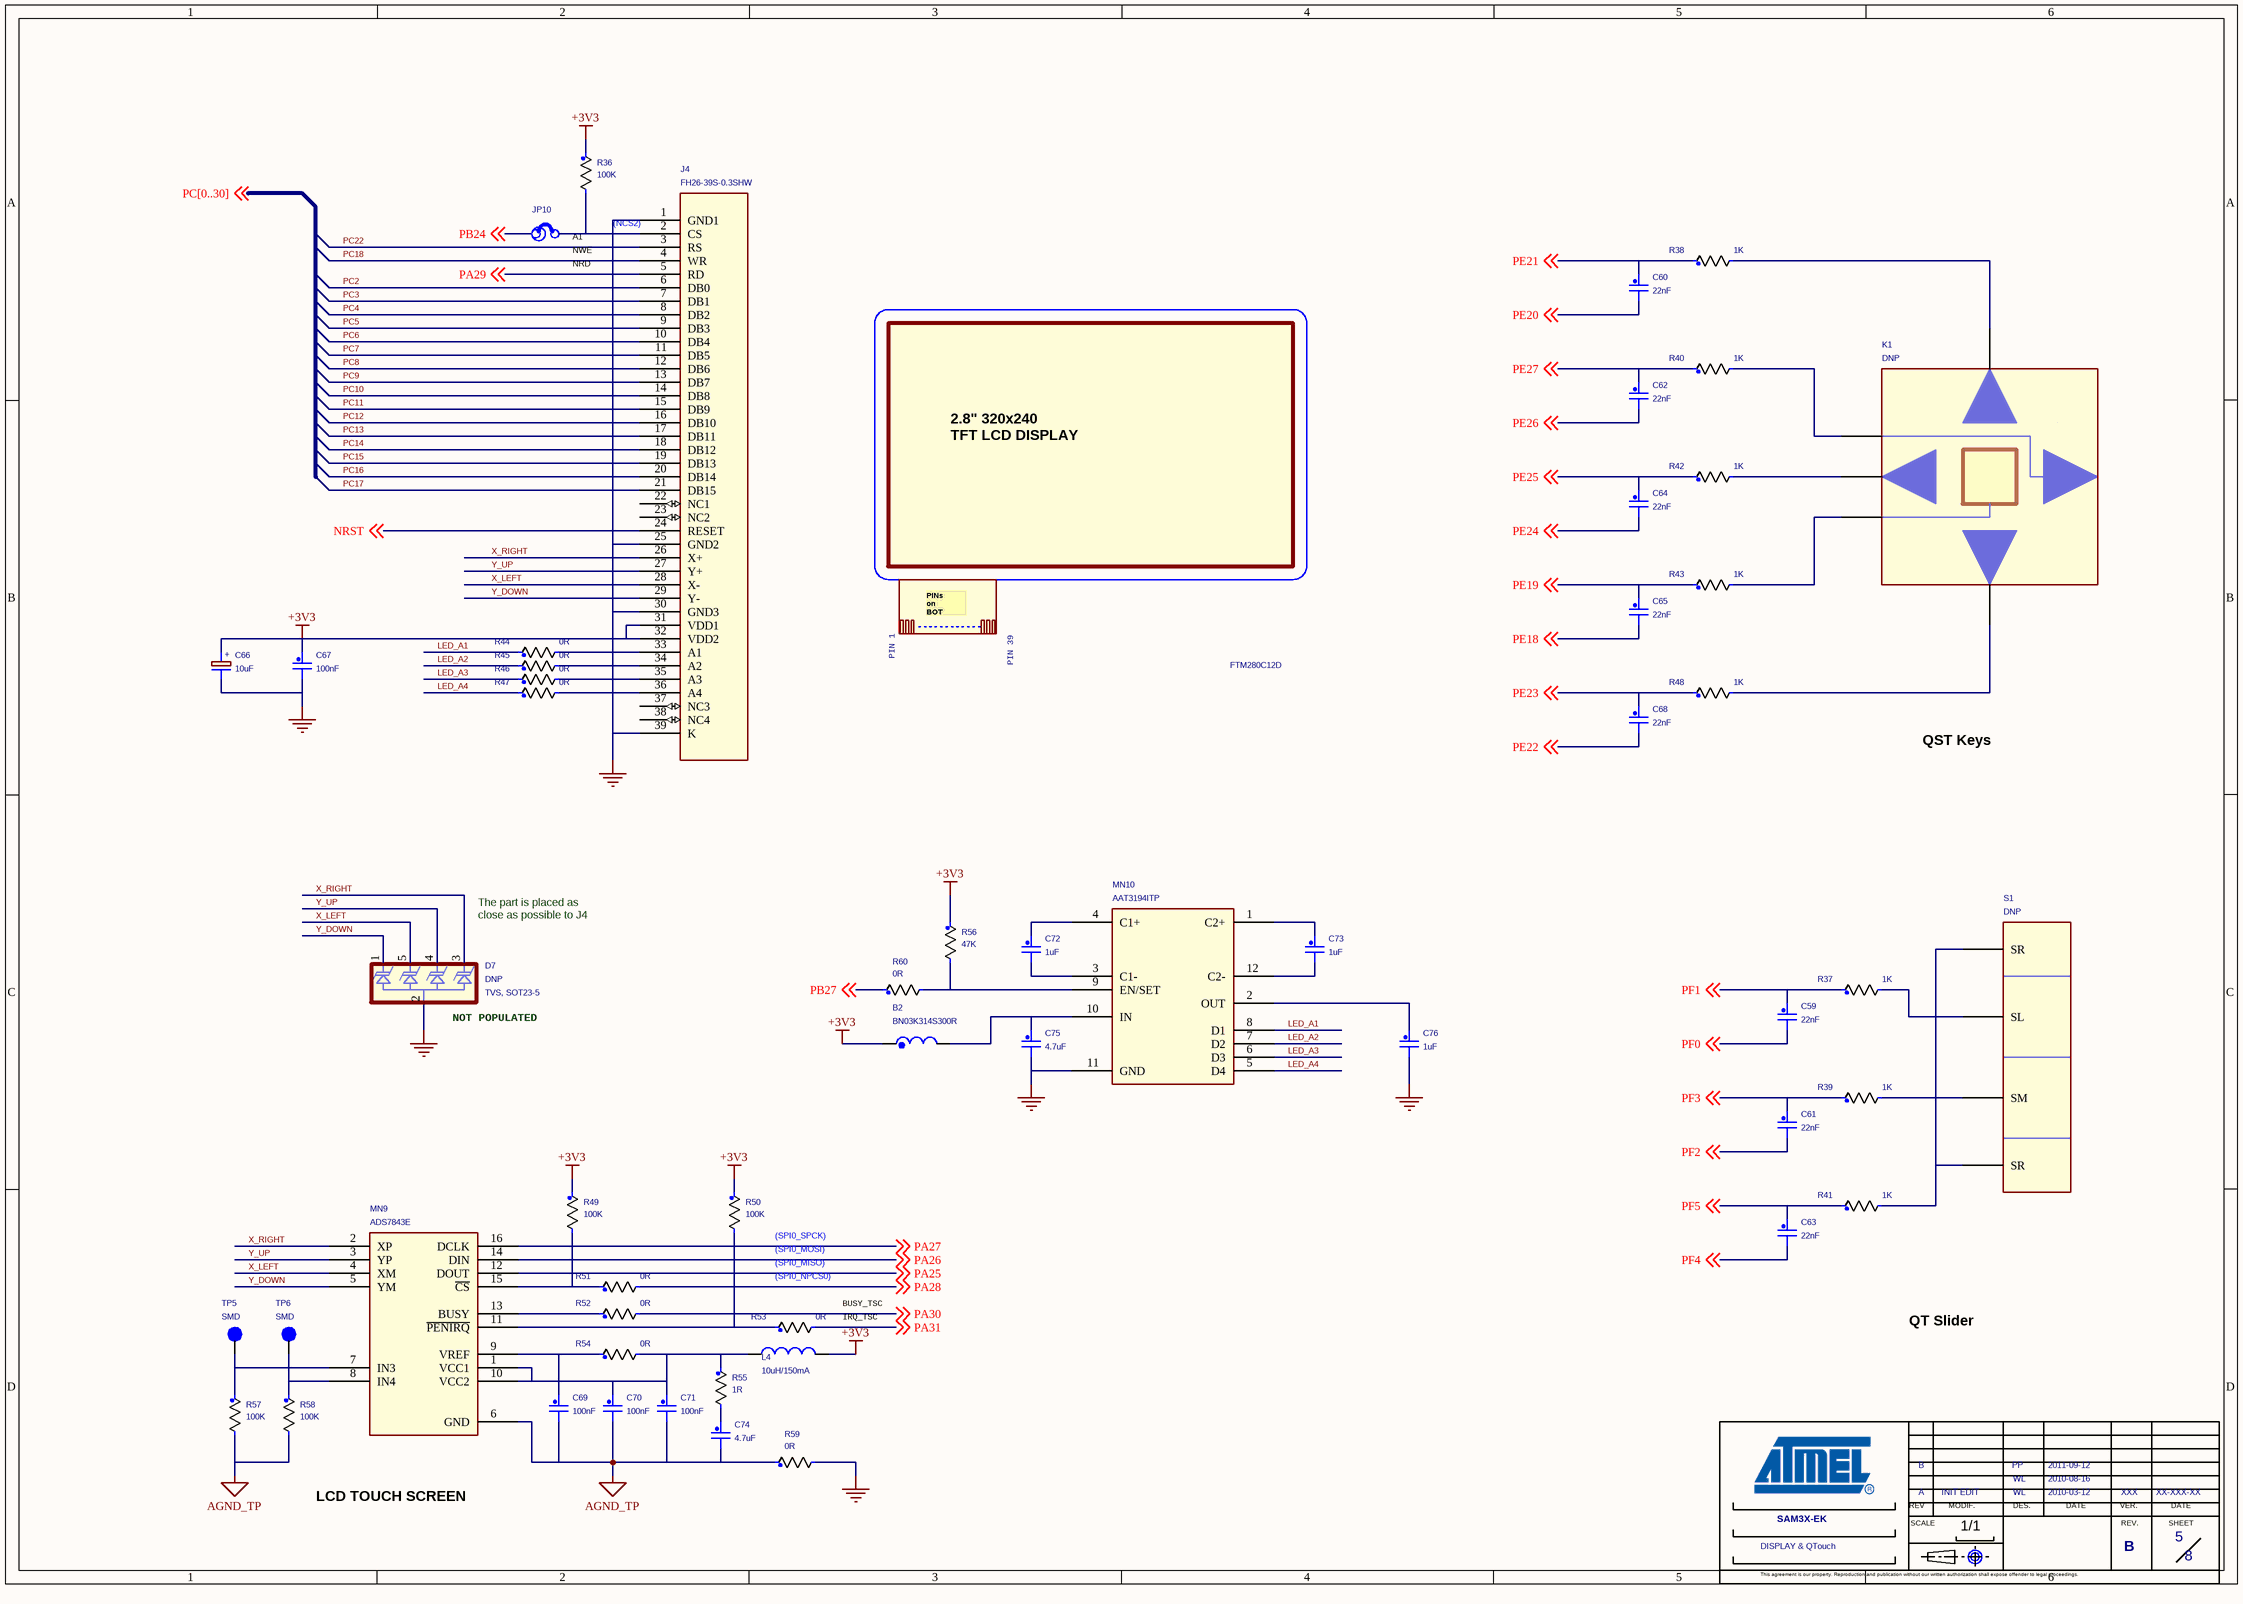
[diagram p3: 05_DISPLAY & QTouch.SchDoc]

### Parts
(Parts that share a designator on the sheet are numbered #1, #2 ... from top to bottom, then left to right.)
*#4  SHEET NAME 1: DISPLAY & QTouch  REV C: B  VERIF A: XXX  VERIF DATE A: XX-XXX-XX  Page Count: 8  Page Number: 5  DATE A: 2010-03-12  DATE B: 2010-08-16  DATE C: 2011-09-12  DES A: WL  DES C: PP  BOARD NAME: SAM3X-EK  VERSION: A  MODIF. DESCRIBE: INIT EDIT  (hidden comment: ATMEL ARM)  (graphical)
B2  BN03K314S300R  [R0603]
C59  22nF  [CAP0805]
C60  22nF  [CAP0805]
C61  22nF  [CAP0805]
C62  22nF  [CAP0805]
C63  22nF  [CAP0805]
C64  22nF  [CAP0805]
C65  22nF  [CAP0805]
C66  10uF  [C3216-18]
C67  100nF  [CAP0805]
C68  22nF  [CAP0805]
C69  100nF  [CAP0805]
C70  100nF  [CAP0805]
C71  100nF  [CAP0805]
C72  1uF  [CAP0805]
C73  1uF  [CAP0805]
C74  4.7uF  [CAP0805]
C75  4.7uF  [CAP0805]
C76  1uF  [CAP0805]
D7  DNP  Note: TVS, SOT23-5  [SOT23-5]
J4  FH26-39S-0.3SHW  [FH26_39S_03SHW]
JP10  JP  [BAR2PTS02]  (value not drawn)
K1  DNP  [qkeys]
L4  10uH/150mA  [NLFV25T]
MN9  ADS7843E  [SSOP16]
MN10  AAT3194ITP  [TSOPJW-12]
R36  100K  [R0603]
R37  1K  [r0603]
R38  1K  [r0603]
R39  1K  [r0603]
R40  1K  [r0603]
R41  1K  [r0603]
R42  1K  [r0603]
R43  1K  [r0603]
R44  0R  [R0603]
R45  0R  [R0603]
R46  0R  [R0603]
R47  0R  [R0603]
R48  1K  [r0603]
R49  100K  [r0603]
R50  100K  [r0603]
R51  0R  [r0603]
R52  0R  [r0603]
R53  0R  [r0603]
R54  0R  [r0603]
R55  1R  [r0603]
R56  47K  [R0603]
R57  100K  [r0603]
R58  100K  [r0603]
R59  0R  [r0603]
R60  0R  [R0603]
S1  DNP  [E1106]
SH16  Jumper Pitch 2.54  [JUMPER-2.54]  (value not drawn)
TP5  SMD  [P1A]
TP6  SMD  [P1A]
Z8  VAL: FTM280C12D  [Mechanic]  (hidden comment: LB043WQ1)

### Nets
+3V3: B2.1 C66.1 C67.1 J4.31(VDD1) J4.32(VDD2) L4.1 R36.1 R49.1 R50.1 R56.1
AGND_TP: C69.2 C70.2 C71.2 C74.2 MN9.6(GND) R57.2 R58.2 R59.1
GND_POWER: C66.2 C67.2 C75.2 C76.2 D7.2(COM) J4.1(GND1) J4.25(GND2) J4.30(GND3) J4.39(K) MN10.11(GND) R59.2
LED_A1: MN10.8(D1) R44.1
LED_A2: MN10.7(D2) R45.1
LED_A3: MN10.6(D3) R46.1
LED_A4: MN10.5(D4) R47.1
NRST: J4.24(RESET) ; off-sheet NRST
PA25: MN9.12(DOUT) ; off-sheet PA25
PA26: MN9.14(DIN) ; off-sheet PA26
PA27: MN9.16(DCLK) ; off-sheet PA27
PA28: R51.2 ; off-sheet PA28
PA29: J4.5(RD) ; off-sheet PA29
PA30: R52.2 ; off-sheet PA30
PA31: R53.2 ; off-sheet PA31
PB24: JP10.1 ; off-sheet PB24
PB27: R60.1 ; off-sheet PB27
PC2: J4.6(DB0)
PC3: J4.7(DB1)
PC4: J4.8(DB2)
PC5: J4.9(DB3)
PC6: J4.10(DB4)
PC7: J4.11(DB5)
PC8: J4.12(DB6)
PC9: J4.13(DB7)
PC10: J4.14(DB8)
PC11: J4.15(DB9)
PC12: J4.16(DB10)
PC13: J4.17(DB11)
PC14: J4.18(DB12)
PC15: J4.19(DB13)
PC16: J4.20(DB14)
PC17: J4.21(DB15)
PC18: J4.4(WR)
PC22: J4.3(RS)
PE18: C65.2 ; off-sheet PE18
PE19: C65.1 R43.1 ; off-sheet PE19
PE20: C60.2 ; off-sheet PE20
PE21: C60.1 R38.1 ; off-sheet PE21
PE22: C68.2 ; off-sheet PE22
PE23: C68.1 R48.1 ; off-sheet PE23
PE24: C64.2 ; off-sheet PE24
PE25: C64.1 R42.1 ; off-sheet PE25
PE26: C62.2 ; off-sheet PE26
PE27: C62.1 R40.1 ; off-sheet PE27
PF0: C59.2 ; off-sheet PF0
PF1: C59.1 R37.1 ; off-sheet PF1
PF2: C61.2 ; off-sheet PF2
PF3: C61.1 R39.1 ; off-sheet PF3
PF4: C63.2 ; off-sheet PF4
PF5: C63.1 R41.1 ; off-sheet PF5
X_LEFT: D7.5(K4) J4.28(X-) MN9.4(XM)
X_RIGHT: D7.3(K2) J4.26(X+) MN9.2(XP)
Y_DOWN: D7.1(K1) J4.29(Y-) MN9.5(YM)
Y_UP: D7.4(K3) J4.27(Y+) MN9.3(YP)
NetB2_2: B2.2 C75.1 MN10.10(IN)
NetC69_1: C69.1 MN9.9(VREF) R54.1
NetC70_1: C70.1 C71.1 L4.2 MN9.1(VCC1) MN9.10(VCC2) R54.2 R55.1
NetC72_1: C72.1 MN10.4(C1+)
NetC72_2: C72.2 MN10.3(C1-)
NetC73_1: C73.1 MN10.1(C2+)
NetC73_2: C73.2 MN10.12(C2-)
NetC74_1: C74.1 R55.2
NetC76_1: C76.1 MN10.2(OUT)
NetJ4_2: J4.2(CS) JP10.2 R36.2
NetJ4_33: J4.33(A1) R44.2
NetJ4_34: J4.34(A2) R45.2
NetJ4_35: J4.35(A3) R46.2
NetJ4_36: J4.36(A4) R47.2
NetK1_1: K1.1 R38.2
NetK1_2: K1.2 R40.2
NetK1_3: K1.3 R42.2
NetK1_4: K1.4 R43.2
NetK1_5: K1.5 R48.2
NetMN9_7: MN9.7(IN3) R57.1 TP5.1(TP)
NetMN9_8: MN9.8(IN4) R58.1 TP6.1(TP)
NetMN9_11: MN9.11(~{PENIRQ}) R50.2 R53.1
NetMN9_13: MN9.13(BUSY) R52.1
NetMN9_15: MN9.15(~{CS}) R49.2 R51.1
NetMN10_9: MN10.9(EN/SET) R56.2 R60.2
NetR37_2: R37.2 S1.2(SL)
NetR39_2: R39.2 S1.3(SM)
NetR41_2: R41.2 S1.1(SR) S1.4(SR)

Not connected (* = marked no-connect by the designer): J4 22(NC1) 23(NC2) 37(NC3) 38(NC4)

### Notes on the sheet
- (near JP10) A1
- (near JP10) NWE
- (NCS2)
- (near JP10) NRD
- 2.8" 320x240
  TFT LCD DISPLAY
- QST Keys
- (near D7) The part is placed as
  close as possible to J4
- (near D7) NOT POPULATED
- (near R50) (SPI0_MOSI)
- (near R50) (SPI0_SPCK)
- (SPI0_MISO)
- (SPI0_NPCS0)
- IRQ_TSC
- BUSY_TSC
- QT Slider
- LCD TOUCH SCREEN
- (in symbol ATMEL ARM) REV; MODIF.; DES.; DATE; VER.; SCALE; REV.; SHEET; 1/1; This agreement is our property. Reproduction and publication without our written authorization shall expose offender to legal proceedings.
- (in symbol CAP_PN) +
- (in symbol display_LB043WQ1_3) PINs / on / BOT; PIN 1; PIN 39

### Library data of the parts
*#4 = ATMEL ARM: REV D: D; REV F: F; REV E: E; REV B: B; VERIF F: XXX; VERIF E: XXX; VERIF D: XXX; VERIF C: XXX; VERIF B: XXX; VERIF DATE F: XX-XXX-XX; VERIF DATE E: XX-XXX-XX; VERIF DATE D: XX-XXX-XX; VERIF DATE C: XX-XXX-XX; REV: B; VERIF DATE B: XX-XXX-XX; FT: ?; Page Size: A; Page Create Date: june 19, 2004; DATE D: XX-XXX-XX; DATE E: XX-XXX-XX; DATE F: XX-XXX-XX; DES E: XXX; DES F: XXX; DES B: WL; DES D: XXX
B2 = BEAD: BOI: 0603; DESIG: SMD EMI Suppression Ferrite Beads; FAB: GAUSSTEK GARP; REF: BN03K314S300R; VAL: BN03K314S300R
C59 C60 C63 C64 C68 = C_Generic: Toler.: 10%; P/N #1: C0603C104K4RAC; Voltage: 16V; Mfg #1: KEMET; Dielectric: X7R; BOI: 0603; DESIG: Ceramic Capacitor; DEV: C0603; FAB: TDK; REF: C1608X7R1C223KT; VAL: 22nF; TEN: 16V; TOL: 10%
C61 C62 C65 = C_Generic: Toler.: 10%; P/N #1: C0603C104K4RAC; Voltage: 16V; Mfg #1: KEMET; Dielectric: X7R; REF: C1608X7R1C223KT; FAB: TDK; DEV: C0603; DESIG: Ceramic Capacitor; BOI: 0603; TOL: 10%; TEN: 16V; VAL: 22nF
C66 = CAP_PN: as C132 on sheet 08_SERIAL & USER INTERF; VAL: 10uF
C67 C69-C71 = C_Generic: as C119 on sheet 08_SERIAL & USER INTERF; TOL: 10%; TEN: 16V; VAL: 100nF
C72 C73 C76 = C_Generic: Toler.: 10%; P/N #1: C0603C104K4RAC; Voltage: 16V; Mfg #1: KEMET; Dielectric: X5R; TEN: 50V; REF: C1608X5R1H105KT; FAB: TDK; DEV: C0603; DESIG: X5R CERAMIC CAPACITOR; BOI: 0603; TOL: 10%; VAL: 1uF
C74 C75 = C_Generic: Toler.: 10%; P/N #1: C0603C104K4RAC; Voltage: 16V; Mfg #1: KEMET; Dielectric: X5R; REF: C2012X5R1C475KT; FAB: TDK; DEV: C0805; DESIG: X5R CERAMIC CAPACITOR; BOI: 0805; TOL: 10%; TEN: 16V; VAL: 4.7uF
D7 = PACDN: FAB: California Micro Devices; DESIG: ESD Protectors; REF: PACDN044Y5R; BOI: SOT23-5; DEV: SOT23-5; VAL: PACDN044Y5R
J4 = FH26-39S: FAB: HRS; REF: FH26-39S-0.3SHW
JP10 = JUMP_0: as JP14 on sheet 08_SERIAL & USER INTERF; VAL: 045
K1 = keys: DESIG: QTouch Key; Val: NOT POPULATED
L4 = L_0: as L5 on sheet 06_Audio & HSMCI & TWI; VAL: 10uH/150mA
MN9 = ADS7843E: BOI: SSOP-16; DESIG: TOUCH SCREEN CONTROLLER; FAB: TI; DEV: SSOP-16; REF: ADS7843E; VAL: ADS7843E
MN10 = AAT3194: VAL: AAT3194ITP-20-T1; FAB: ANALOGIC TECH; DESIG: Charge Pump For White LED Applications; REF: AAT3194ITP-20-T1; DEV: TSOPJW-12; BOI: TSOPJW-12
R36 R49 R50 = R_Generic: as R111 on sheet 08_SERIAL & USER INTERF; VAL: 100K; DEV: R0603
R37-R40 R48 = R_Generic: as R97 on sheet 07_ETHERNET & ZIGBEE; VAL: 1K; DEV: R0603
R41-R43 = R_Generic: P/N #1: CR10-1001F-T; BOI: 0603; DESIG: RC21 5%; FAB: YAGEO; REF: RC0603JR-071KL; TOL: 5%; DEV: R0603; VAL: 1K
R44 R46 R52 R54 R59 R60 = R_Generic: as R109 on sheet 08_SERIAL & USER INTERF; VAL: 0R; DEV: R0603
R45 R47 R51 R53 = R_Generic: as R113 on sheet 08_SERIAL & USER INTERF; DEV: R0603; VAL: 0R
R55 = R_Generic: P/N #1: CR10-1001F-T; TOL: 5%; REF: RC0603JR-071RL; FAB: YAGEO; DESIG: RC21 5%; BOI: 0603; VAL: 1R; DEV: R0603
R56 = R_Generic: as R115 on sheet 08_SERIAL & USER INTERF; VAL: 47K; DEV: R0603
R57 R58 = R_Generic: as R112 on sheet 08_SERIAL & USER INTERF; DEV: R0603; VAL: 100K
S1 = QSlider_0: DESIG: QTouch Slider; Val: NOT POPULATED
SH16 = JUMPER-2.54: as SH20 on sheet 08_SERIAL & USER INTERF; DESIG: 2 POINTS JUMPER PITCH 2.54; VAL: JUMPER 2.54; BOI: NA; Part Type: Jumper
TP5 = TP: VAL: NOT POPULATED; REF: NA; DESIG: testing PAD; FAB: NA
TP6 = TP: as TP7 on sheet 07_ETHERNET & ZIGBEE; REF: NA
Z8 = display_LB043WQ1_3: REF: LB043WQ1

## Sheet 04_EBI_MEMORY.SchDoc
size 420 x 297 mm
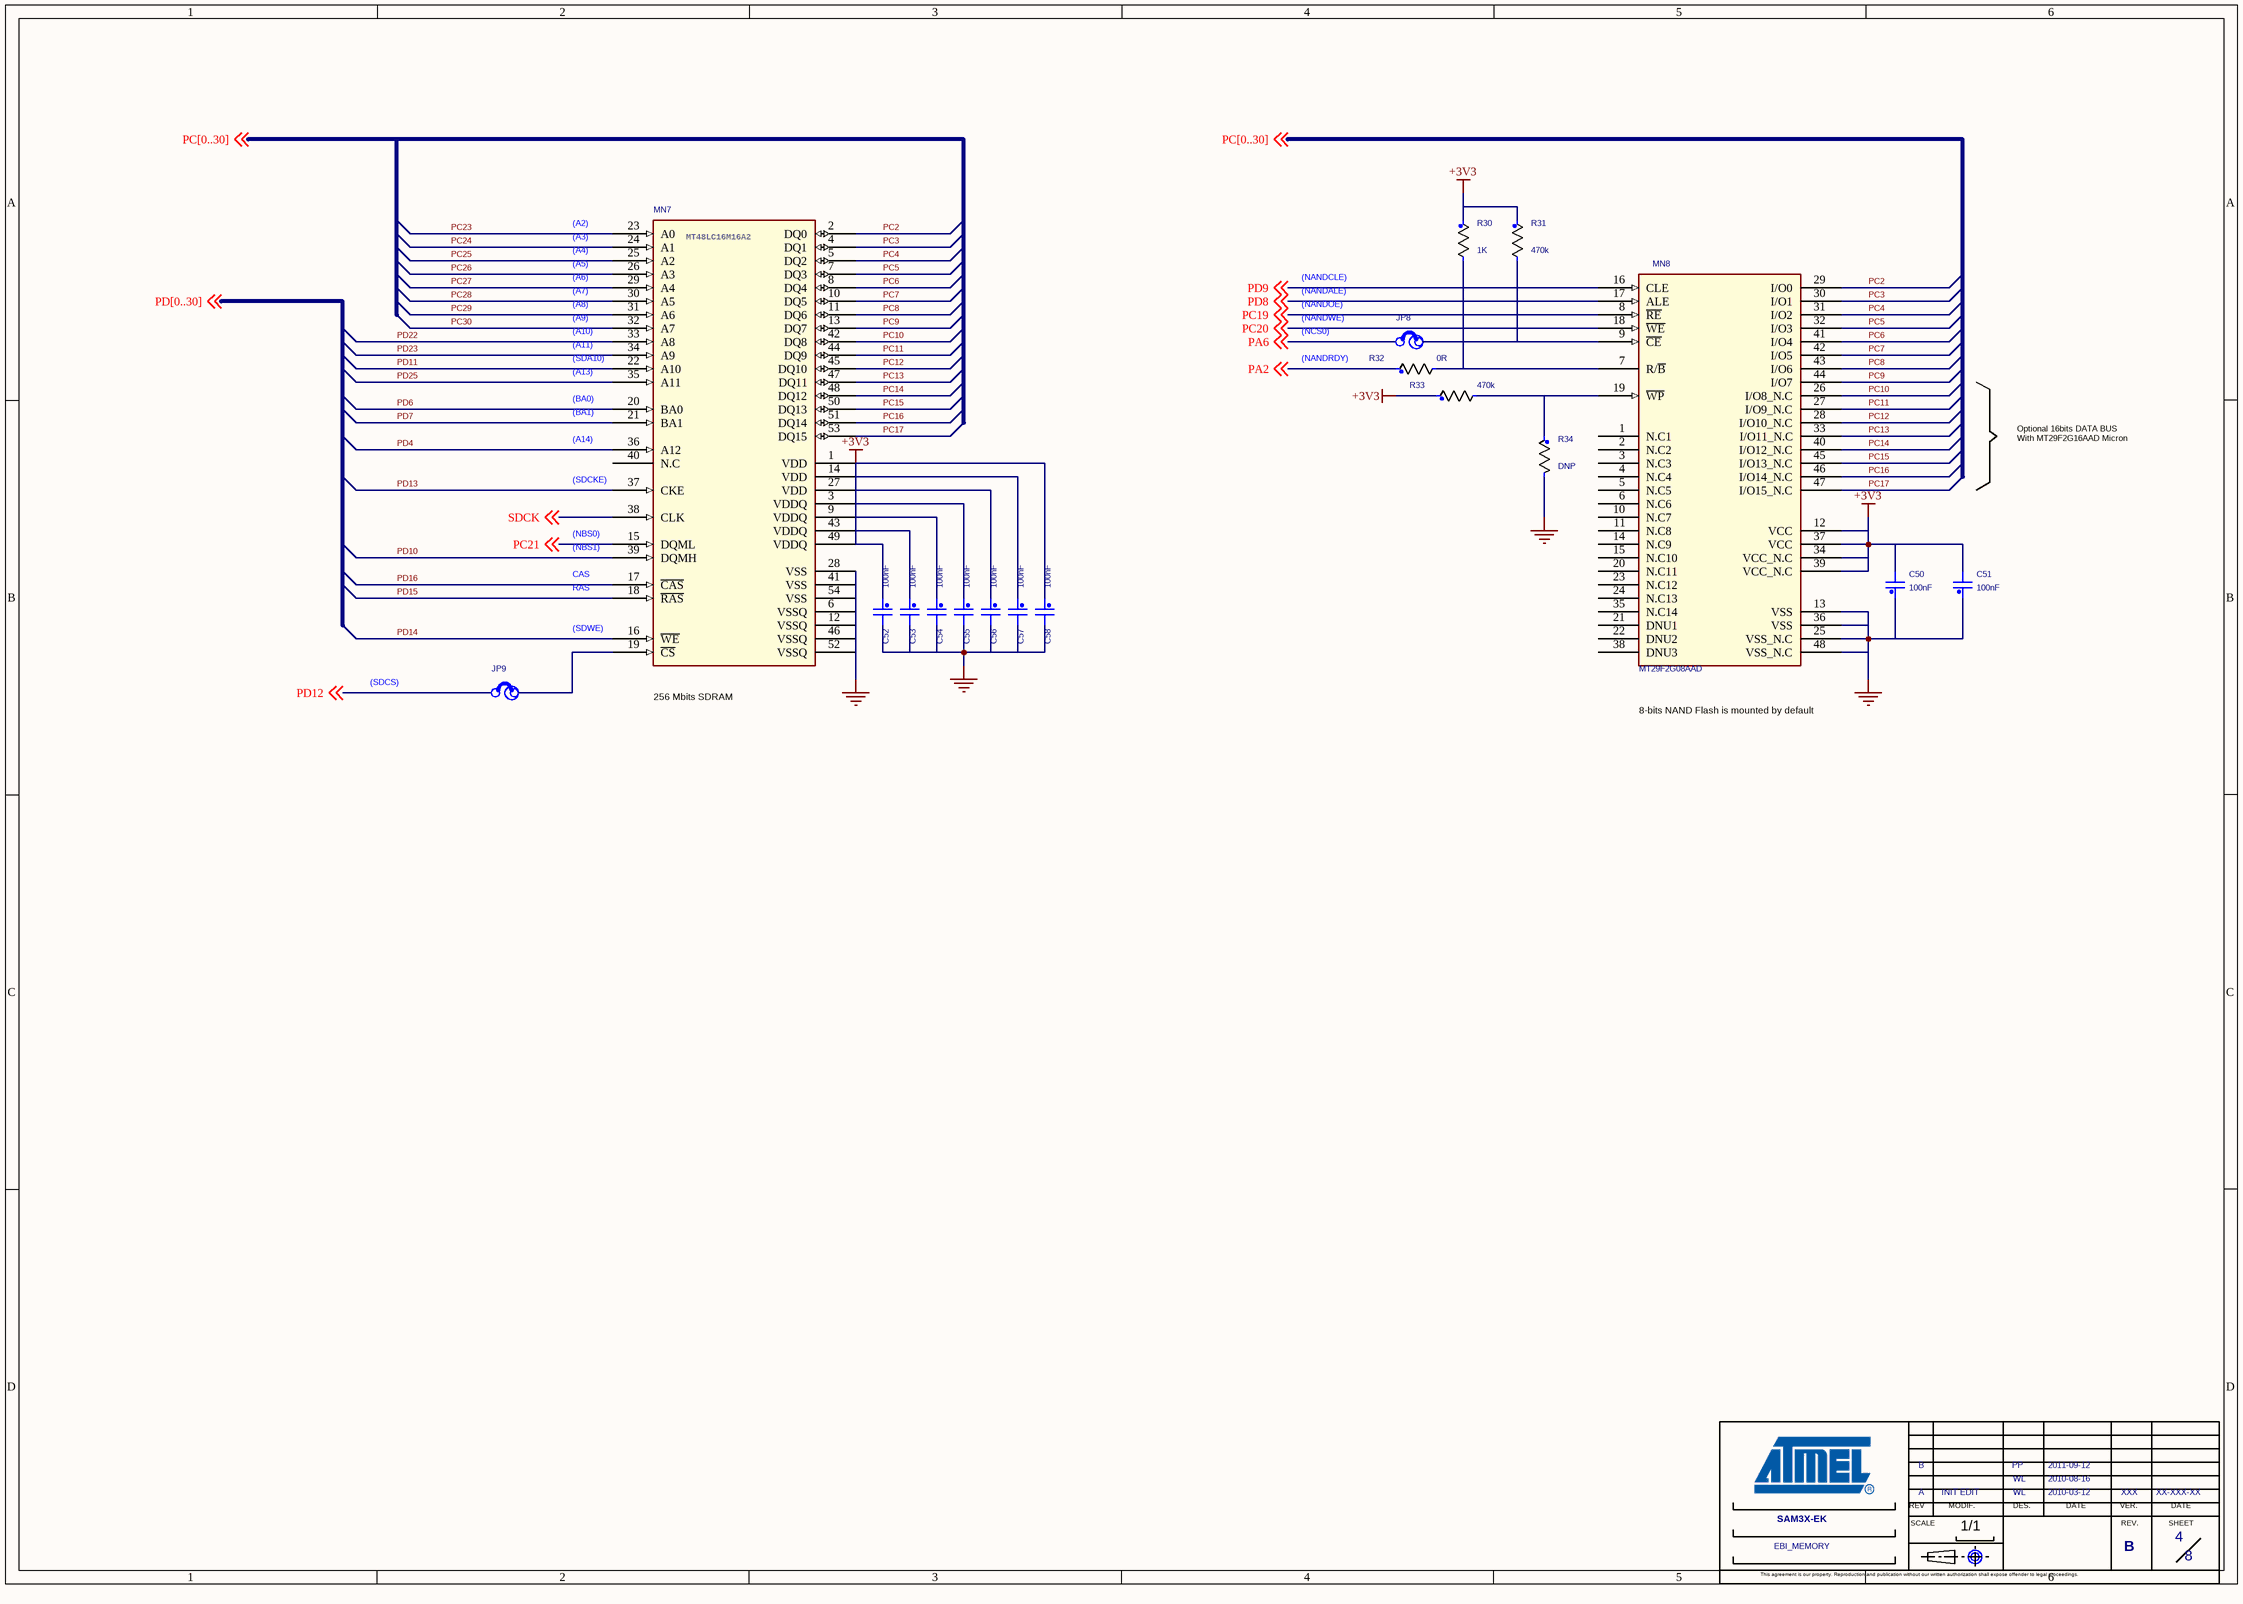
[diagram p4: 04_EBI_MEMORY.SchDoc]

### Parts
(Parts that share a designator on the sheet are numbered #1, #2 ... from top to bottom, then left to right.)
*#5  SHEET NAME 1: EBI_MEMORY  REV C: B  VERIF A: XXX  VERIF DATE A: XX-XXX-XX  Page Count: 8  Page Number: 4  DATE A: 2010-03-12  DATE B: 2010-08-16  DATE C: 2011-09-12  DES A: WL  DES C: PP  BOARD NAME: SAM3X-EK  VERSION: A  MODIF. DESCRIBE: INIT EDIT  (hidden comment: ATMEL ARM)  (graphical)
C50  100nF  [CAP0805]
C51  100nF  [CAP0805]
C52  100nF  [CAP0805]
C53  100nF  [CAP0805]
C54  100nF  [CAP0805]
C55  100nF  [CAP0805]
C56  100nF  [CAP0805]
C57  100nF  [CAP0805]
C58  100nF  [CAP0805]
JP8  JP  [BAR2PTS02]  (value not drawn)
JP9  JP  [BAR2PTS02]  (value not drawn)
MN7  MT48LC8M16A2TG-75  [TSOP54_01]  (value not drawn)
MN8  MT29F2G08AAD  [TSOP48]
R30  1K  [r0603]
R31  470k  [R0603]
R32  0R  [R0603]
R33  470k  [R0603]
R34  DNP  [R0603]
SH14  Jumper Pitch 2.54  [JUMPER-2.54]  (value not drawn)
SH15  Jumper Pitch 2.54  [JUMPER-2.54]  (value not drawn)

### Nets
+3V3: C50.2 C51.2 C52.1 C53.1 C54.1 C55.1 C56.1 C57.1 C58.1 MN7.1(VDD) MN7.3(VDDQ) MN7.9(VDDQ) MN7.14(VDD) MN7.27(VDD) MN7.43(VDDQ) MN7.49(VDDQ) MN8.12(VCC) MN8.34(VCC_N.C) MN8.37(VCC) MN8.39(VCC_N.C) R30.1 R31.1 R33.1
GND_POWER: C50.1 C51.1 C52.2 C53.2 C54.2 C55.2 C56.2 C57.2 C58.2 MN7.6(VSSQ) MN7.12(VSSQ) MN7.28(VSS) MN7.41(VSS) MN7.46(VSSQ) MN7.52(VSSQ) MN7.54(VSS) MN8.13(VSS) MN8.25(VSS_N.C) MN8.36(VSS) MN8.48(VSS_N.C) R34.2
PA2: R32.1 ; off-sheet PA2
PA6: JP8.2 ; off-sheet PA6
PC2: MN7.2(DQ0) MN8.29(I/O0)
PC3: MN7.4(DQ1) MN8.30(I/O1)
PC4: MN7.5(DQ2) MN8.31(I/O2)
PC5: MN7.7(DQ3) MN8.32(I/O3)
PC6: MN7.8(DQ4) MN8.41(I/O4)
PC7: MN7.10(DQ5) MN8.42(I/O5)
PC8: MN7.11(DQ6) MN8.43(I/O6)
PC9: MN7.13(DQ7) MN8.44(I/O7)
PC10: MN7.42(DQ8) MN8.26(I/O8_N.C)
PC11: MN7.44(DQ9) MN8.27(I/O9_N.C)
PC12: MN7.45(DQ10) MN8.28(I/O10_N.C)
PC13: MN7.47(DQ11) MN8.33(I/O11_N.C)
PC14: MN7.48(DQ12) MN8.40(I/O12_N.C)
PC15: MN7.50(DQ13) MN8.45(I/O13_N.C)
PC16: MN7.51(DQ14) MN8.46(I/O14_N.C)
PC17: MN7.53(DQ15) MN8.47(I/O15_N.C)
PC19: MN8.8(~{RE}) ; off-sheet PC19
PC20: MN8.18(~{WE}) ; off-sheet PC20
PC21: MN7.15(DQML) ; off-sheet PC21
PC23: MN7.23(A0)
PC24: MN7.24(A1)
PC25: MN7.25(A2)
PC26: MN7.26(A3)
PC27: MN7.29(A4)
PC28: MN7.30(A5)
PC29: MN7.31(A6)
PC30: MN7.32(A7)
PD4: MN7.36(A12)
PD6: MN7.20(BA0)
PD7: MN7.21(BA1)
PD8: MN8.17(ALE) ; off-sheet PD8
PD9: MN8.16(CLE) ; off-sheet PD9
PD10: MN7.39(DQMH)
PD11: MN7.22(A10)
PD12: JP9.2 ; off-sheet PD12
PD13: MN7.37(CKE)
PD14: MN7.16(~{WE})
PD15: MN7.18(~{RAS})
PD16: MN7.17(~{CAS})
PD22: MN7.33(A8)
PD23: MN7.34(A9)
PD25: MN7.35(A11)
SDCK: MN7.38(CLK) ; off-sheet SDCK
NetJP8_1: JP8.1 MN8.9(~{CE}) R31.2
NetJP9_1: JP9.1 MN7.19(~{CS})
NetMN8_7: MN8.7(R/~{B}) R30.2 R32.2
NetMN8_19: MN8.19(~{WP}) R33.2 R34.1

Not connected (* = marked no-connect by the designer): MN7 40(N.C); MN8 1(N.C1) 2(N.C2) 3(N.C3) 4(N.C4) 5(N.C5) 6(N.C6) 10(N.C7) 11(N.C8) 14(N.C9) 15(N.C10) 20(N.C11) 21(DNU1) 22(DNU2) 23(N.C12) 24(N.C13) 35(N.C14) 38(DNU3)

### Notes on the sheet
- (A2)
- (A3)
- (A4)
- (A5)
- (A6)
- (A7)
- (A8)
- (A9)
- (NANDALE)
- (NANDCLE)
- (NANDWE)
- (NANDOE)
- (near MN7) (SDA10)
- (A10)
- (A11)
- (A13)
- (NCS0)
- (NANDRDY)
- (A14)
- (BA0)
- (BA1)
- Optional 16bits DATA BUS
  With MT29F2G16AAD Micron
- (near MN7) (SDCKE)
- (NBS0)
- (NBS1)
- CAS
- RAS
- (SDWE)
- (SDCS)
- (near MN7) 256 Mbits SDRAM
- 8-bits NAND Flash is mounted by default
- (in symbol ATMEL ARM) REV; MODIF.; DES.; DATE; VER.; SCALE; REV.; SHEET; 1/1; This agreement is our property. Reproduction and publication without our written authorization shall expose offender to legal proceedings.
- (in symbol MT48LC16M16A2TG) MT48LC16M16A2

### Library data of the parts
*#5 = ATMEL ARM: REV D: D; REV F: F; REV E: E; REV B: B; VERIF F: XXX; VERIF E: XXX; VERIF D: XXX; VERIF C: XXX; VERIF B: XXX; VERIF DATE F: XX-XXX-XX; VERIF DATE E: XX-XXX-XX; VERIF DATE D: XX-XXX-XX; VERIF DATE C: XX-XXX-XX; REV: B; VERIF DATE B: XX-XXX-XX; FT: ?; Page Size: A; Page Create Date: june 19, 2004; DATE D: XX-XXX-XX; DATE E: XX-XXX-XX; DATE F: XX-XXX-XX; DES E: XXX; DES F: XXX; DES B: WL; DES D: XXX
C50 C51 = C_Generic: as C119 on sheet 08_SERIAL & USER INTERF; TOL: 10%; TEN: 16V; VAL: 100nF
C52-C58 = C_Generic: as C120 on sheet 08_SERIAL & USER INTERF; VAL: 100nF; TEN: 16V; TOL: 10%
JP8 JP9 = JUMP_0: as JP14 on sheet 08_SERIAL & USER INTERF; VAL: 045
MN7 = MT48LC16M16A2TG: VAL: MT48LC16M16A2TG-75; DESIG: SDRAM 4M x 16 x 4; BOI: TSOP54; FAB: MICRON; ID: ATLFIC017; REF: MT48LC16M16A2TG-75; DEV: TSOP54_01
MN8 = MT29F2GxxAAD: DEV: CIS_TSOP48_01; FAB: Micron; DESIG: NANDFLASH; TEN: 2,7..3,6V; RoHS: YES; BOI: TSOP48
R30 = R_Generic: as R41 on sheet 05_DISPLAY & QTouch; DEV: R0603; VAL: 1K
R31 R33 = R_Generic: P/N #1: CR10-1001F-T; TOL: 5%; REF: RC0603JR-07470KL; FAB: YAGEO; DESIG: RC21 5%; BOI: 0603; VAL: 470K; DEV: R0603
R32 = R_Generic: as R113 on sheet 08_SERIAL & USER INTERF; DEV: R0603; VAL: 0R
R34 = R_Generic: as R118 on sheet 08_SERIAL & USER INTERF; DEV: R0603
SH14 SH15 = JUMPER-2.54: as SH20 on sheet 08_SERIAL & USER INTERF; DESIG: 2 POINTS JUMPER PITCH 2.54; VAL: JUMPER 2.54; BOI: NA; Part Type: Jumper